# EasyEDA Pro project 焊接烟雾净化器.eprj

# Schematic 焊接烟雾净化器V1.2
Create Date: 2023-09-26; Page Name: P1; Project Name: 焊接烟雾净化器; Schematic Name: 焊接烟雾净化器V1.2; Update Date: 2023-09-26; Company: 嘉立创EDA; Page Size: A3; Version: V1.0
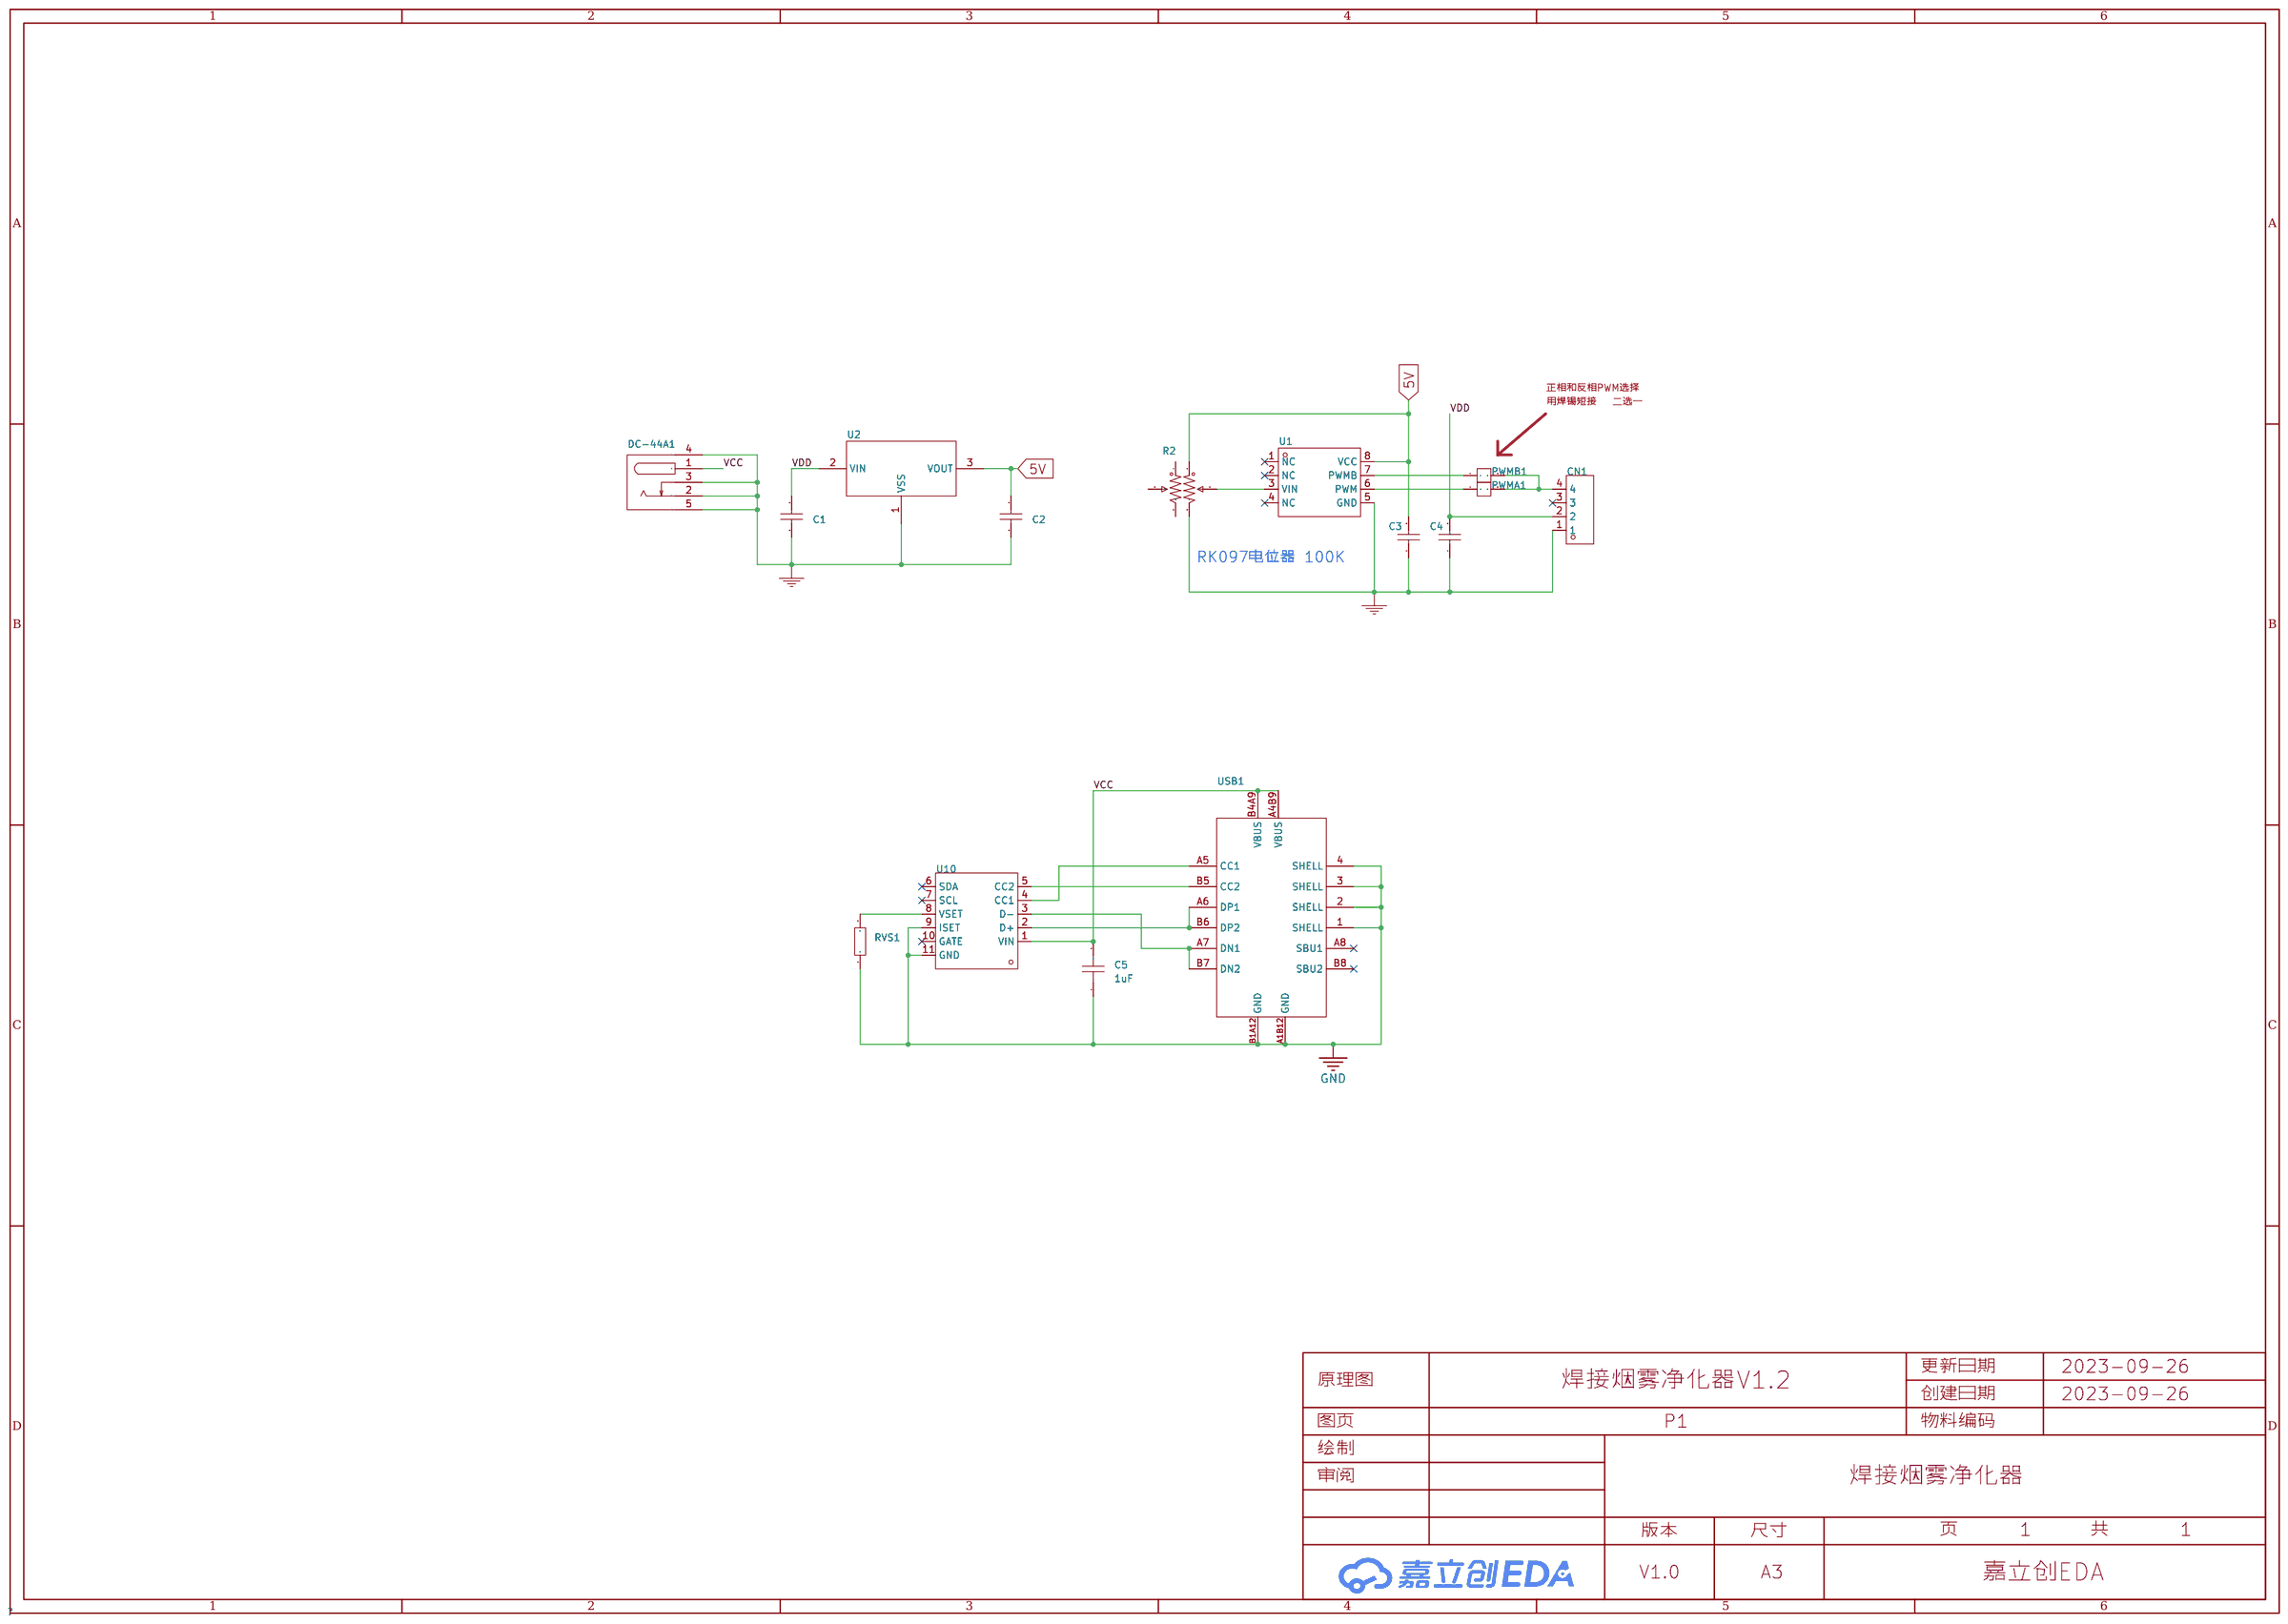
[diagram p0: schematic sheet]

## Parts
C1  10uF  [C0603]
C2  10uF  [C0603]
C3  10uF  [C0603]
C4  10uF  [C0603]
C5  1uF  [C0603]
CN1  KF2510-4AGW-GW  [CONN-TH_4P-P2.54_CAX_KF2510-4AGW-GW]
DC-44A1  DC-044A-20A  [DC-IN-TH_DC-044A-20A]
PWMA1  -  [cs]
PWMB1  -  [cs]
R2  100kΩ  [RES-ADJ-TH_RK09712200MY]
RVS1  10kΩ  [R0603]
U1  GP9101-F20K-L2H1-SW  [SOP-8_L5.0-W3.9-P1.27-LS6.0-BL]
U2  ME6203A50PG  [SOT-89_L4.5-W2.5-P1.50-LS4.2-BR]
U10  HUSB238-002D  [TDFN-10_L3.0-W3.0-P0.50-BL-EP]
USB1  -  [USB_C-SMD_TYPE_C16PIN]

## Library data of the parts
C1-C4 = GRM188R6YA106MA73D: 容值:10uF;精度:±20%;额定电压:35V;材质(温度系数):-;; LCSC Part Name: 10uF ±20% 35V; Supplier Part: C194427; Manufacturer: muRata(村田); Supplier Footprint: 0603; JLCPCB Part Class: Extended Part; Datasheet: https://atta.szlcsc.com/upload/public/pdf/source/20210128/C194427_FCA3640823207DDB58700A82F1A19B5F.pdf; Supplier: LCSC; Tolerance: ±20%; Voltage Rated: 35V
C5 = CL10A105KL8NNNC: 容值:1uF;精度:±10%;额定电压:35V;材质(温度系数):-;; LCSC Part Name: 1uF ±10% 35V; Supplier Part: C478859; Manufacturer: SAMSUNG(三星); Supplier Footprint: 0603; JLCPCB Part Class: 扩展库; Datasheet: https://atta.szlcsc.com/upload/public/pdf/source/20200102/C478859_0EBF0387113597ECF4C91C52A34CAFD4.pdf; Supplier: LCSC; Tolerance: ±10%; Voltage Rated: 35V
CN1 = KF2510-4AGW-GW: 参考系列:-;间距:2.54mm;插针结构:1x4P;排数:1;每排PIN数:4;行距:-;公母:公型插针;安装方式:弯插;额定电流:3A;工作温度范围:-25℃~+85℃;; LCSC Part Name: 2.54mm 1x4P 弯插; Supplier Part: C722747; Manufacturer: CAX(创都); Supplier Footprint: 弯插,P=2.54mm; JLCPCB Part Class: 扩展库; Datasheet: https://atta.szlcsc.com/upload/public/pdf/source/20200903/C722719_349FB032BA69A16250788D6DAC1BEE3A.pdf; Supplier: LCSC; Pitch: 2.54mm; Pins Structure: 1x4P; Number of Rows: 1; Number of PINs Per Row: 4; Gender: 公型插针; Mounting Style: 弯插; Current Rating (Max): 3A; Operating Temperature Range: -25℃~+85℃
DC-44A1 = DC-044A-20A: 触点内径:2mm;触点外径:0.9mm;; LCSC Part Name: DC座 内铁芯2.0 11.6mm*10.1mm; Supplier Part: C129006; Manufacturer: 韩国韩荣; Supplier Footprint: Through Hole; JLCPCB Part Class: 扩展库; Datasheet: https://atta.szlcsc.com/upload/public/pdf/source/20210810/C8974B0AB7FDF70EB0A74D74746E6460.pdf; Supplier: LCSC; Inside Contact Diameter: 2mm; Outside Contact Diameter: 0.9mm
PWMA1 PWMB1 = cs
R2 = RK09712200MY: 阻值:10kΩ;精度:±20%;; LCSC Part Name: 10kΩ ±20% 三件套; Supplier Part: C231763; Manufacturer: ALPSALPINE(阿尔卑斯阿尔派); Supplier Footprint: 插件; JLCPCB Part Class: 扩展库; Datasheet: https://atta.szlcsc.com/upload/public/pdf/source/20180613/C231763_9E66DA42F71BD8737D63C600D8EF512E.pdf; Supplier: LCSC; Tolerance: ±20%
RVS1 = 0603WAF1002T5E: 电阻类型:厚膜电阻;阻值:10kΩ;精度:±1%;功率:100mW;; LCSC Part Name: 厚膜电阻 10kΩ ±1% 100mW; Supplier Part: C25804; Manufacturer: UNI-ROYAL(厚声); Supplier Footprint: 0603; JLCPCB Part Class: 基础库; Datasheet: https://atta.szlcsc.com/upload/public/pdf/source/20200306/C422600_1E6D84923E4A46A82E41ADD87F860B5C.pdf; Supplier: LCSC; Type: 厚膜电阻; Tolerance: ±1%; Power(Watts): 100mW; Temperature Coefficient: ±100ppm/℃; Overload Voltage (Max): 75V; Operating Temperature Range: -55℃~+155℃
U1 = GP9101-F20K-L2H1-SW: GP9101 0-VCC转PWM 20KHz L2H1; LCSC Part Name: 模拟信号转PWM信号; Supplier Part: C2837710; Manufacturer: Guestgood(客益); Supplier Footprint: SOP8; JLCPCB Part Class: 扩展库; Datasheet: https://atta.szlcsc.com/upload/public/pdf/source/20210611/C2837710_B55E2012AD9BA99B0BFF632E52DE3359.pdf; Supplier: LCSC
U2 = ME6203A50PG: 输出类型:固定;输出极性:正;输出通道数:1;最大输入电压:30V;输出电压:5V;压差:-;输出电流:100mA;电源纹波抑制比(PSRR):40dB@(1kHz);; LCSC Part Name: 正 Vin=30V Vout=5V 100mA 40dB@(1kHz); Supplier Part: C94056; Manufacturer: MICRONE(南京微盟); Supplier Footprint: SOT-89; JLCPCB Part Class: 扩展库; Datasheet: https://atta.szlcsc.com/upload/public/pdf/source/20170116/1484561288466.pdf; Supplier: LCSC; Output Type: 固定; Output Polarity: 正; Number of Outputs: 1; Maximum Input Voltage: 30V; Output Voltage: 5V; Output Current: 100mA; Power Supply Rejection Ratio (PSRR): 40dB@(1kHz)
U10 = HUSB238-002D: Supplier Part: C2765038; JLCPCB Part Class: 扩展库; Supplier: LCSC
USB1 = TYPE-C16P: Supplier: LCSC; Supplier Part: C393939; Manufacturer: SHOU HAN; Manufacturer Part: TYPE-C16PIN; JLCPCB Part Class: 扩展库

## Nets
5V: C2.2 C3.2 R2.1 U1.8(VCC) U2.3(VOUT)
GND: C1.1 C2.1 C3.1 C4.1 C5.1 CN1.1 DC-44A1.2 DC-44A1.3 DC-44A1.4 DC-44A1.5 R2.3 RVS1.1 U1.5(GND) U2.1(VSS) U10.9(ISET) U10.11(GND) USB1.1(SHELL) USB1.2(SHELL) USB1.3(SHELL) USB1.4(SHELL) USB1.A1B12(GND) USB1.B1A12(GND)
VCC: C5.2 DC-44A1.1 U10.1(VIN) USB1.A4B9(VBUS) USB1.B4A9(VBUS)
VDD: C1.2 C4.2 CN1.2 U2.2(VIN)
$1N762: R2.2 U1.3(VIN)
$1N878: U10.5(CC2) USB1.B5(CC2)
$1N881: U10.4(CC1) USB1.A5(CC1)
$1N891: RVS1.2 U10.8(VSET)
$1N943: U10.2(D+) USB1.A6(DP1) USB1.B6(DP2)
$1N946: U10.3(D-) USB1.A7(DN1) USB1.B7(DN2)
$1N1655: PWMA1.1 U1.6(PWM)
$1N1658: PWMB1.1 U1.7(PWMB)
$1N1664: CN1.4 PWMA1.2 PWMB1.2

Not connected (* = marked no-connect by the designer): CN1 3*; R2 4 5 6; U1 1(NC)* 2(NC)* 4(NC)*; U10 6(SDA)* 7(SCL)* 10(GATE)*; USB1 A8(SBU1)* B8(SBU2)*

## Notes on the sheet
- 正相和反相PWM选择
- 用焊锡短接   二选一
- RK097电位器 100K

# Schematic Schematic1
Create Date: 2023-09-26; Page Name: P1; Project Name: 焊接烟雾净化器; Schematic Name: Schematic1; Update Date: 2023-09-26; Company: 嘉立创EDA; Page Size: A4; Version: V1.0
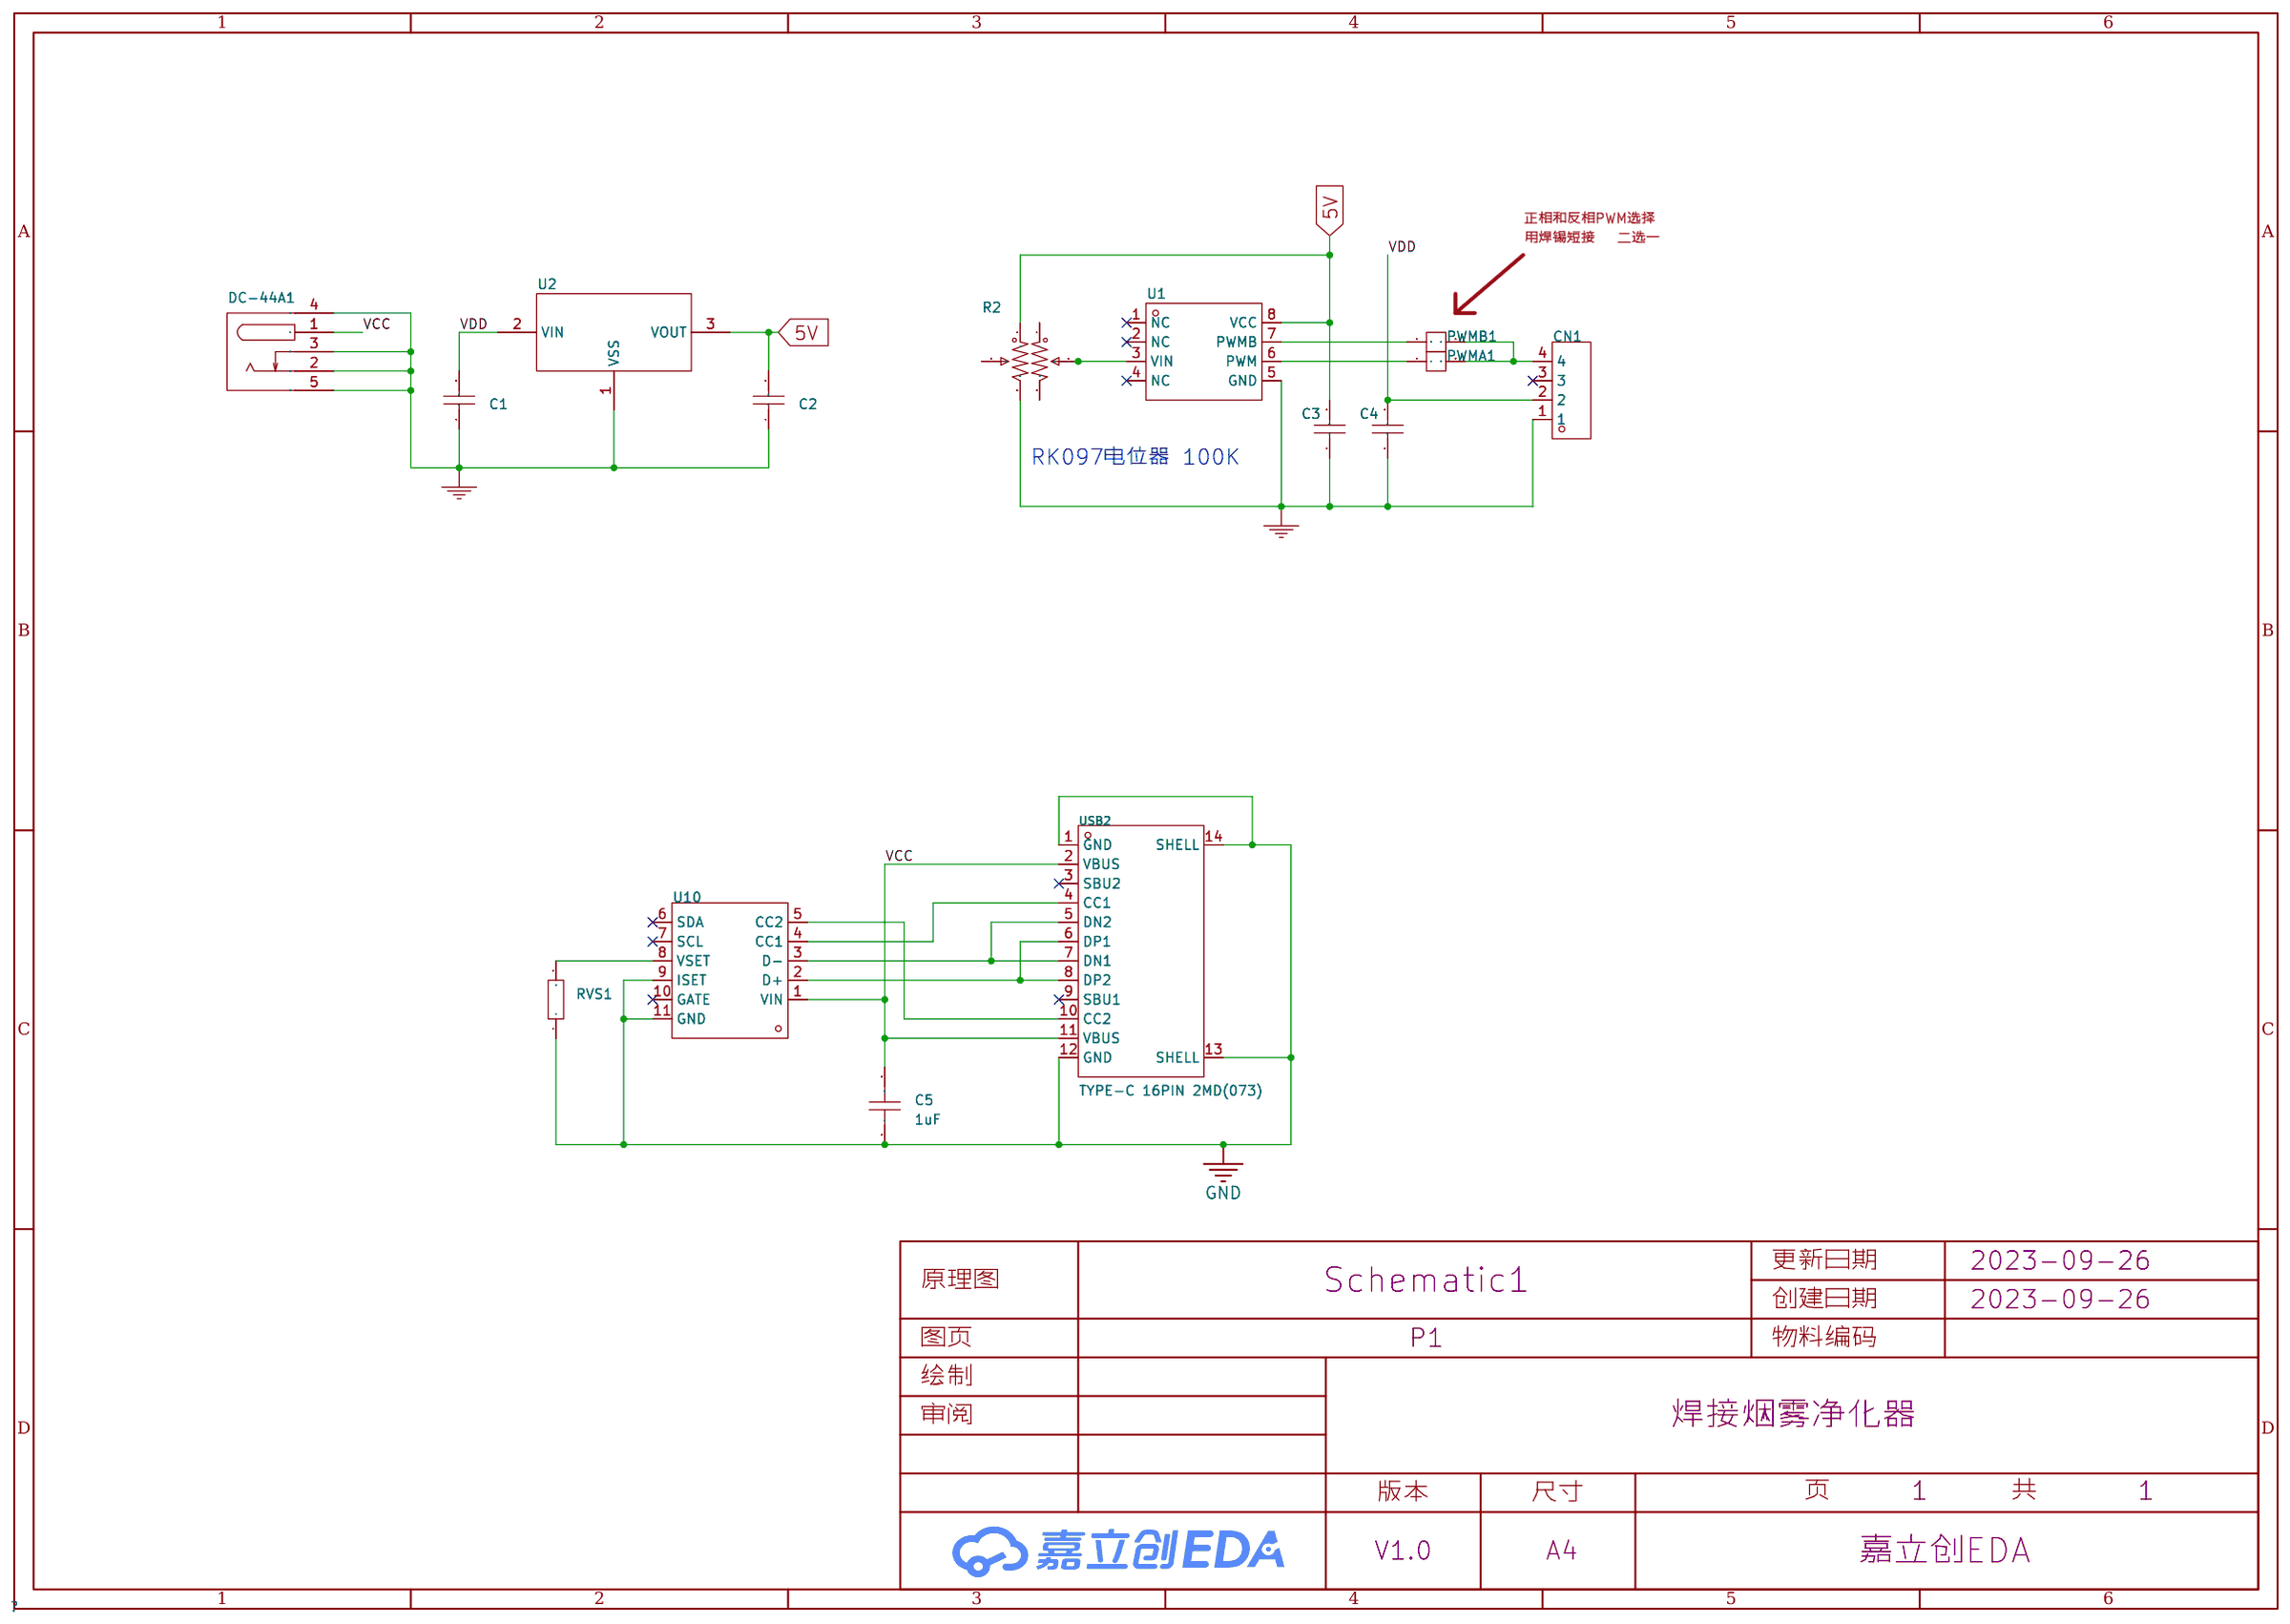
[diagram p1: schematic sheet]

## Parts
C1  10uF  [C0603]
C2  10uF  [C0603]
C3  10uF  [C0603]
C4  10uF  [C0603]
C5  1uF  [C0603]
CN1  KF2510-4AGW-GW  [CONN-TH_4P-P2.54_CAX_KF2510-4AGW-GW]
DC-44A1  DC-044A-20A  [DC-IN-TH_DC-044A-20A]
PWMA1  -  [cs]
PWMB1  -  [cs]
R2  10kΩ  [RES-ADJ-TH_RK09712200MY]
RVS1  10kΩ  [R0603]
U1  GP9101-F20K-L2H1-SW  [SOP-8_L5.0-W3.9-P1.27-LS6.0-BL]
U2  AMS1117-5.0  [SOT-89-3_L4.5-W2.5-P1.50-LS4.2-BR]
U10  HUSB238-002D  [TDFN-10_L3.0-W3.0-P0.50-BL-EP]
USB2  TYPE-C 16PIN 2MD(073)  [USB-C-SMD_TYPE-C-6PIN-2MD-073]

## Library data of the parts
C1-C4 = GRM188R6YA106MA73D: 容值:10uF;精度:±20%;额定电压:35V;材质(温度系数):-;; LCSC Part Name: 10uF ±20% 35V; Supplier Part: C194427; Manufacturer: muRata(村田); Supplier Footprint: 0603; JLCPCB Part Class: Extended Part; Datasheet: https://atta.szlcsc.com/upload/public/pdf/source/20210128/C194427_FCA3640823207DDB58700A82F1A19B5F.pdf; Supplier: LCSC; Tolerance: ±20%; Voltage Rated: 35V
C5 = CL10A105KL8NNNC: 容值:1uF;精度:±10%;额定电压:35V;材质(温度系数):-;; LCSC Part Name: 1uF ±10% 35V; Supplier Part: C478859; Manufacturer: SAMSUNG(三星); Supplier Footprint: 0603; JLCPCB Part Class: 扩展库; Datasheet: https://atta.szlcsc.com/upload/public/pdf/source/20200102/C478859_0EBF0387113597ECF4C91C52A34CAFD4.pdf; Supplier: LCSC; Tolerance: ±10%; Voltage Rated: 35V
CN1 = KF2510-4AGW-GW: 参考系列:-;间距:2.54mm;插针结构:1x4P;排数:1;每排PIN数:4;行距:-;公母:公型插针;安装方式:弯插;额定电流:3A;工作温度范围:-25℃~+85℃;; LCSC Part Name: 2.54mm 1x4P 弯插; Supplier Part: C722747; Manufacturer: CAX(创都); Supplier Footprint: 弯插,P=2.54mm; JLCPCB Part Class: 扩展库; Datasheet: https://atta.szlcsc.com/upload/public/pdf/source/20200903/C722719_349FB032BA69A16250788D6DAC1BEE3A.pdf; Supplier: LCSC; Pitch: 2.54mm; Pins Structure: 1x4P; Number of Rows: 1; Number of PINs Per Row: 4; Gender: 公型插针; Mounting Style: 弯插; Current Rating (Max): 3A; Operating Temperature Range: -25℃~+85℃
DC-44A1 = DC-044A-20A: 触点内径:2mm;触点外径:0.9mm;; LCSC Part Name: DC座 内铁芯2.0 11.6mm*10.1mm; Supplier Part: C129006; Manufacturer: 韩国韩荣; Supplier Footprint: Through Hole; JLCPCB Part Class: 扩展库; Datasheet: https://atta.szlcsc.com/upload/public/pdf/source/20210810/C8974B0AB7FDF70EB0A74D74746E6460.pdf; Supplier: LCSC; Inside Contact Diameter: 2mm; Outside Contact Diameter: 0.9mm
PWMA1 PWMB1 = cs
R2 = RK09712200MY: 阻值:10kΩ;精度:±20%;; LCSC Part Name: 10kΩ ±20% 三件套; Supplier Part: C231763; Manufacturer: ALPSALPINE(阿尔卑斯阿尔派); Supplier Footprint: 插件; JLCPCB Part Class: Extended Part; Datasheet: https://atta.szlcsc.com/upload/public/pdf/source/20191107/C444934_DB02548289CDA4D147B389ED0787F1D2.pdf; Supplier: LCSC; Tolerance: ±20%; NO_CONNECT: yes
RVS1 = 0603WAF1002T5E: 电阻类型:厚膜电阻;阻值:10kΩ;精度:±1%;功率:100mW;; LCSC Part Name: 厚膜电阻 10kΩ ±1% 100mW; Supplier Part: C25804; Manufacturer: UNI-ROYAL(厚声); Supplier Footprint: 0603; JLCPCB Part Class: 基础库; Datasheet: https://atta.szlcsc.com/upload/public/pdf/source/20200306/C422600_1E6D84923E4A46A82E41ADD87F860B5C.pdf; Supplier: LCSC; Type: 厚膜电阻; Tolerance: ±1%; Power(Watts): 100mW; Temperature Coefficient: ±100ppm/℃; Overload Voltage (Max): 75V; Operating Temperature Range: -55℃~+155℃
U1 = GP9101-F20K-L2H1-SW: GP9101 0-VCC转PWM 20KHz L2H1; LCSC Part Name: 模拟信号转PWM信号; Supplier Part: C2837710; Manufacturer: Guestgood(客益); Supplier Footprint: SOP8; JLCPCB Part Class: 扩展库; Datasheet: https://atta.szlcsc.com/upload/public/pdf/source/20210611/C2837710_B55E2012AD9BA99B0BFF632E52DE3359.pdf; Supplier: LCSC
U2 = AMS1117-5.0: 输出类型:-;; Supplier Part: C880753; Manufacturer: Slkor(萨科微); Supplier Footprint: SOT-89-3; JLCPCB Part Class: Extended Part; Datasheet: https://atta.szlcsc.com/upload/public/pdf/source/20190906/C426566_95BE246DE70C248781207323626ADB09.pdf; Supplier: LCSC; Output Polarity: 正; Number of Outputs: 1; Maximum Input Voltage: 30V; Output Voltage: 5V; Output Current: 100mA; Power Supply Rejection Ratio (PSRR): 40dB@(1kHz)
U10 = HUSB238-002D: Supplier Part: C2765038; JLCPCB Part Class: 扩展库; Supplier: LCSC
USB2 = TYPE-C 16PIN 2MD(073): 连接器类型:Type-C;标准:-;公母:母座;触点数量:16;端口数量:1;安装方式:卧贴;额定电流 - 电源:5A;工作温度范围:-25℃~+85℃;; LCSC Part Name: TYPE-C母座 16P 4脚插件带定位柱 不锈钢外壳 2次模顶; Supplier Part: C2765186; Manufacturer: SHOU HAN(首韩); Supplier Footprint: SMD; JLCPCB Part Class: Extended Part; Supplier: LCSC; Connector Type: Type-C; Gender: 母座; Number of Contacts: 16; Number of Ports: 1; Mounting Style: 卧贴; Current Rating - Power (Max): 5A; Operating Temperature Range: -25℃~+85℃

## Nets
5V: C2.2 C3.2 R2.1 U1.8(VCC) U2.3(VOUT)
GND: C1.1 C2.1 C3.1 C4.1 C5.1 CN1.1 DC-44A1.2 DC-44A1.3 DC-44A1.4 DC-44A1.5 R2.3 RVS1.1 U1.5(GND) U2.1(VSS) U10.9(ISET) U10.11(GND) USB2.1(GND) USB2.12(GND) USB2.13(SHELL) USB2.14(SHELL)
VCC: C5.2 DC-44A1.1 U10.1(VIN) USB2.2(VBUS) USB2.11(VBUS)
VDD: C1.2 C4.2 CN1.2 U2.2(VIN)
$1N711: RVS1.2 U10.8(VSET)
$1N714: PWMA1.1 U1.6(PWM)
$1N715: PWMB1.1 U1.7(PWMB)
$1N716: CN1.4 PWMA1.2 PWMB1.2
$1N2394: U10.4(CC1) USB2.4(CC1)
$1N2483: U10.3(D-) USB2.5(DN2) USB2.7(DN1)
$1N2497: U10.2(D+) USB2.6(DP1) USB2.8(DP2)
$1N2626: U10.5(CC2) USB2.10(CC2)
Net-(R2-5): R2.5 U1.3(VIN)

Not connected (* = marked no-connect by the designer): CN1 3*; R2 2 4 6; U1 1(NC)* 2(NC)* 4(NC)*; U10 6(SDA)* 7(SCL)* 10(GATE)*; USB2 3(SBU2)* 9(SBU1)*

## Notes on the sheet
- 正相和反相PWM选择
- 用焊锡短接   二选一
- RK097电位器 100K

# Schematic 焊接烟雾净化器v1.3
Create Date: 2023-10-03; Page Name: P1; Project Name: 焊接烟雾净化器; Schematic Name: 焊接烟雾净化器v1.3; Update Date: 2023-10-03; Company: 嘉立创EDA; Page Size: A3; Version: V1.0
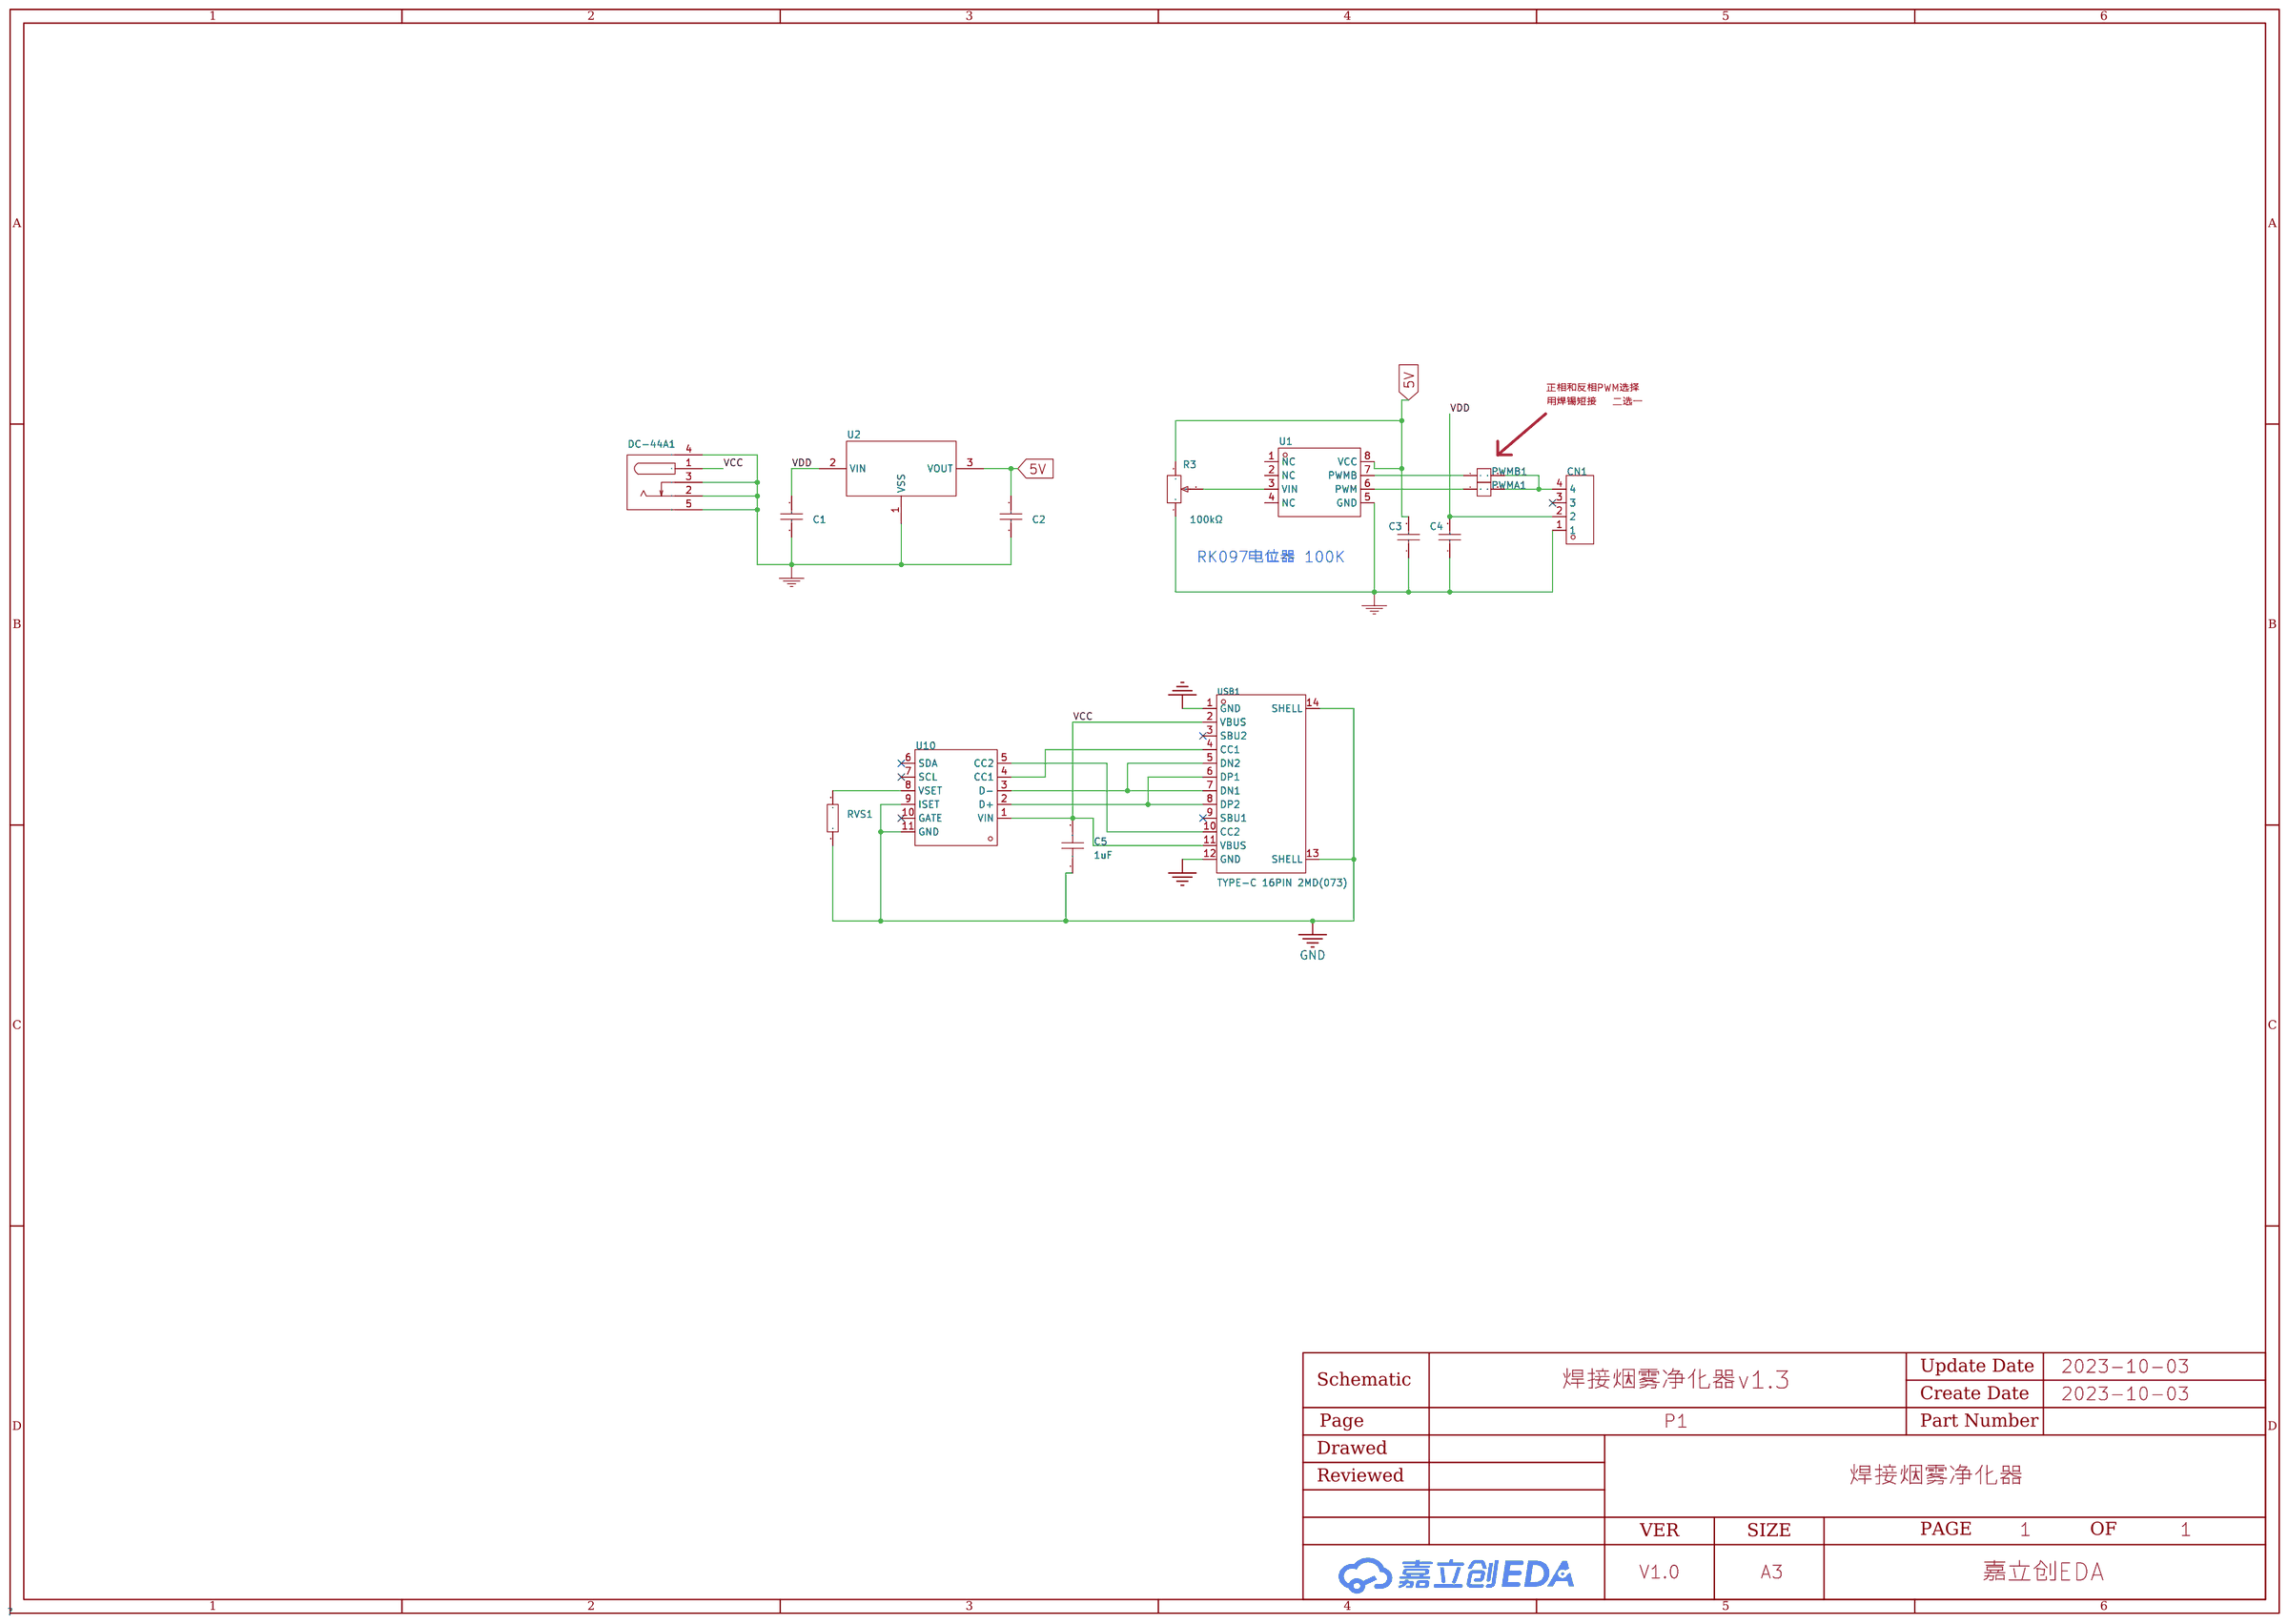
[diagram p2: schematic sheet]

## Parts
C1  10uF  [C0603]
C2  10uF  [C0603]
C3  10uF  [C0603]
C4  10uF  [C0603]
C5  1uF  [C0603]
CN1  KF2510-4AGW-GW  [CONN-TH_4P-P2.54_CAX_KF2510-4AGW-GW]
DC-44A1  DC-044A-20A  [DC-IN-TH_DC-044A-20A]
PWMA1  -  [cs]
PWMB1  -  [cs]
R3  100kΩ  [RES-ADJ-TH_3296X-8MM]
RVS1  10kΩ  [R0603]
U1  GP9101-F1K-L2H1-SW  [SOP-8_L5.0-W3.9-P1.27-LS6.0-BL]
U2  ME6203A50PG  [SOT-89_L4.5-W2.5-P1.50-LS4.2-BR]
U10  HUSB238_002DD  [DFN-10_L3.0-W3.0-P0.50-BL-EP2.5]
USB1  TYPE-C 16PIN 2MD(073)  [USB-C-SMD_TYPE-C-6PIN-2MD-073]

## Library data of the parts
C1-C4 = GRM188R6YA106MA73D: 容值:10uF;精度:±20%;额定电压:35V;材质(温度系数):-;; LCSC Part Name: 10uF ±20% 35V; Supplier Part: C194427; Manufacturer: muRata(村田); Supplier Footprint: 0603; JLCPCB Part Class: Extended Part; Datasheet: https://atta.szlcsc.com/upload/public/pdf/source/20210128/C194427_FCA3640823207DDB58700A82F1A19B5F.pdf; Supplier: LCSC; Tolerance: ±20%; Voltage Rated: 35V
C5 = CL10A105KL8NNNC: 容值:1uF;精度:±10%;额定电压:35V;材质(温度系数):-;; LCSC Part Name: 1uF ±10% 35V; Supplier Part: C478859; Manufacturer: SAMSUNG(三星); Supplier Footprint: 0603; JLCPCB Part Class: 扩展库; Datasheet: https://atta.szlcsc.com/upload/public/pdf/source/20200102/C478859_0EBF0387113597ECF4C91C52A34CAFD4.pdf; Supplier: LCSC; Tolerance: ±10%; Voltage Rated: 35V
CN1 = KF2510-4AGW-GW: 参考系列:-;间距:2.54mm;插针结构:1x4P;排数:1;每排PIN数:4;行距:-;公母:公型插针;安装方式:弯插;额定电流:3A;工作温度范围:-25℃~+85℃;; LCSC Part Name: 2.54mm 1x4P 弯插; Supplier Part: C722747; Manufacturer: CAX(创都); Supplier Footprint: 弯插,P=2.54mm; JLCPCB Part Class: 扩展库; Datasheet: https://atta.szlcsc.com/upload/public/pdf/source/20200903/C722719_349FB032BA69A16250788D6DAC1BEE3A.pdf; Supplier: LCSC; Pitch: 2.54mm; Pins Structure: 1x4P; Number of Rows: 1; Number of PINs Per Row: 4; Gender: 公型插针; Mounting Style: 弯插; Current Rating (Max): 3A; Operating Temperature Range: -25℃~+85℃
DC-44A1 = DC-044A-20A: 触点内径:2mm;触点外径:0.9mm;; LCSC Part Name: DC座 内铁芯2.0 11.6mm*10.1mm; Supplier Part: C129006; Manufacturer: 韩国韩荣; Supplier Footprint: Through Hole; JLCPCB Part Class: 扩展库; Datasheet: https://atta.szlcsc.com/upload/public/pdf/source/20210810/C8974B0AB7FDF70EB0A74D74746E6460.pdf; Supplier: LCSC; Inside Contact Diameter: 2mm; Outside Contact Diameter: 0.9mm
PWMA1 PWMB1 = cs
R3 = 3296X-1-104-8mm: 阻值:100kΩ;精度:±10%;; LCSC Part Name: 100kΩ ±10% 长柄8mm; Supplier Part: C330448; Manufacturer: BOCHEN(博晨); Supplier Footprint: 插件; JLCPCB Part Class: Extended Part; Datasheet: https://atta.szlcsc.com/upload/public/pdf/source/20181127/C330448_9E17BB69C73330C275A71CD6ED25E106.pdf; Supplier: LCSC; Tolerance: ±10%
RVS1 = 0603WAF1002T5E: 电阻类型:厚膜电阻;阻值:10kΩ;精度:±1%;功率:100mW;; LCSC Part Name: 厚膜电阻 10kΩ ±1% 100mW; Supplier Part: C25804; Manufacturer: UNI-ROYAL(厚声); Supplier Footprint: 0603; JLCPCB Part Class: 基础库; Datasheet: https://atta.szlcsc.com/upload/public/pdf/source/20200306/C422600_1E6D84923E4A46A82E41ADD87F860B5C.pdf; Supplier: LCSC; Type: 厚膜电阻; Tolerance: ±1%; Power(Watts): 100mW; Temperature Coefficient: ±100ppm/℃; Overload Voltage (Max): 75V; Operating Temperature Range: -55℃~+155℃
U1 = GP9101-F1K-L2H1-SW: GP9101 0-VCC转PWM 1KHz L2H1; LCSC Part Name: 模拟信号转PWM信号; Supplier Part: C2837704; Manufacturer: Guestgood(客益); Supplier Footprint: SOP-8; JLCPCB Part Class: Extended Part; Datasheet: https://atta.szlcsc.com/upload/public/pdf/source/20230324/347DFD6DABD5C2E507926BD64C336E27.pdf; Supplier: LCSC
U2 = ME6203A50PG: 输出类型:固定;输出极性:正;输出通道数:1;最大输入电压:30V;输出电压:5V;压差:-;输出电流:100mA;电源纹波抑制比(PSRR):40dB@(1kHz);; LCSC Part Name: 正 Vin=30V Vout=5V 100mA 40dB@(1kHz); Supplier Part: C94056; Manufacturer: MICRONE(南京微盟); Supplier Footprint: SOT-89; JLCPCB Part Class: 扩展库; Datasheet: https://atta.szlcsc.com/upload/public/pdf/source/20170116/1484561288466.pdf; Supplier: LCSC; Output Type: 固定; Output Polarity: 正; Number of Outputs: 1; Maximum Input Voltage: 30V; Output Voltage: 5V; Output Current: 100mA; Power Supply Rejection Ratio (PSRR): 40dB@(1kHz)
U10 = HUSB238_002DD: HUSB238是一款高度集成的USB PD受电端芯片（PD Sink，也叫PD诱骗芯片）。传输的额定功率可达100W。它兼容PD3.0 V1.3和Type-C V1.4。它还可以支持BC1.2 DCP、CDP和SDP和Apple 5V2.4A充电协议。这种方案也被称为桶形连接器替换(Barrel Connector Replacement)，旨在替代传统的桶形连接器和DC插座(DC JACK)。HUSB238已经获得USB-IF认证，TID3666。它可以用于具有传统桶形连接器或USB micro-B电源; Supplier Part: C7471904; Manufacturer: Hynetek(慧能泰); Supplier Footprint: DFN-10L; JLCPCB Part Class: 扩展库; Supplier: LCSC
USB1 = TYPE-C 16PIN 2MD(073): 连接器类型:Type-C;标准:-;公母:母座;触点数量:16;端口数量:1;安装方式:卧贴;额定电流 - 电源:5A;工作温度范围:-25℃~+85℃;; LCSC Part Name: TYPE-C母座 16P 4脚插件带定位柱 不锈钢外壳 2次模顶; Supplier Part: C2765186; Manufacturer: SHOU HAN(首韩); Supplier Footprint: SMD; JLCPCB Part Class: Extended Part; Supplier: LCSC; Connector Type: Type-C; Gender: 母座; Number of Contacts: 16; Number of Ports: 1; Mounting Style: 卧贴; Current Rating - Power (Max): 5A; Operating Temperature Range: -25℃~+85℃

## Nets
5V: C2.2 C3.2 R3.3 U1.8(VCC) U2.3(VOUT)
GND: C1.1 C2.1 C3.1 C4.1 C5.1 CN1.1 DC-44A1.2 DC-44A1.3 DC-44A1.4 DC-44A1.5 R3.1 RVS1.1 U1.5(GND) U2.1(VSS) U10.9(ISET) U10.11(GND) USB1.1(GND) USB1.12(GND) USB1.13(SHELL) USB1.14(SHELL)
VCC: C5.2 DC-44A1.1 U10.1(VIN) USB1.2(VBUS) USB1.11(VBUS)
VDD: C1.2 C4.2 CN1.2 U2.2(VIN)
$1N762: R3.2 U1.3(VIN)
$1N881: U10.4(CC1) USB1.4(CC1)
$1N891: RVS1.2 U10.8(VSET)
$1N1655: PWMA1.1 U1.6(PWM)
$1N1658: PWMB1.1 U1.7(PWMB)
$1N1664: CN1.4 PWMA1.2 PWMB1.2
$1N2783: U10.5(CC2) USB1.10(CC2)
$1N2796: U10.2(D+) USB1.6(DP1) USB1.8(DP2)
$1N2819: U10.3(D-) USB1.5(DN2) USB1.7(DN1)

Not connected (* = marked no-connect by the designer): CN1 3*; U1 1(NC) 2(NC) 4(NC); U10 6(SDA)* 7(SCL)* 10(GATE)*; USB1 3(SBU2)* 9(SBU1)*

## Notes on the sheet
- 正相和反相PWM选择
- 用焊锡短接   二选一
- RK097电位器 100K

# Board 焊接烟雾净化器V1.2
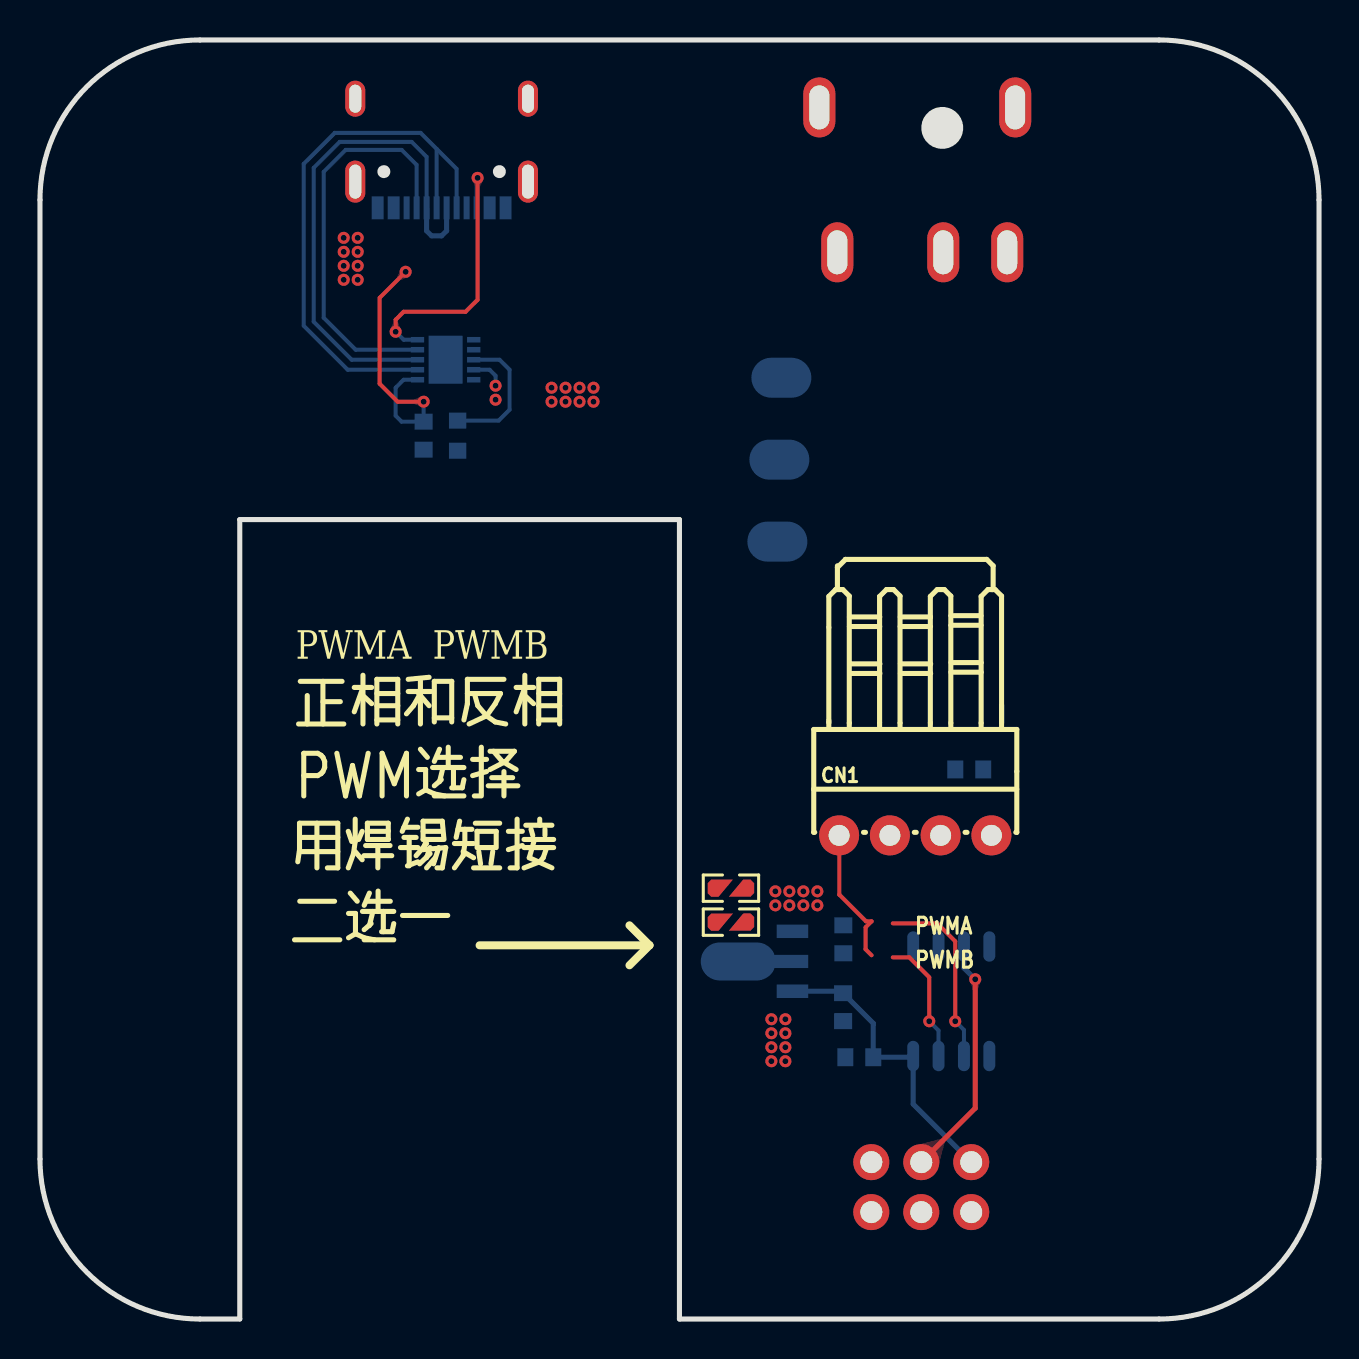
[diagram p3: board, top side]
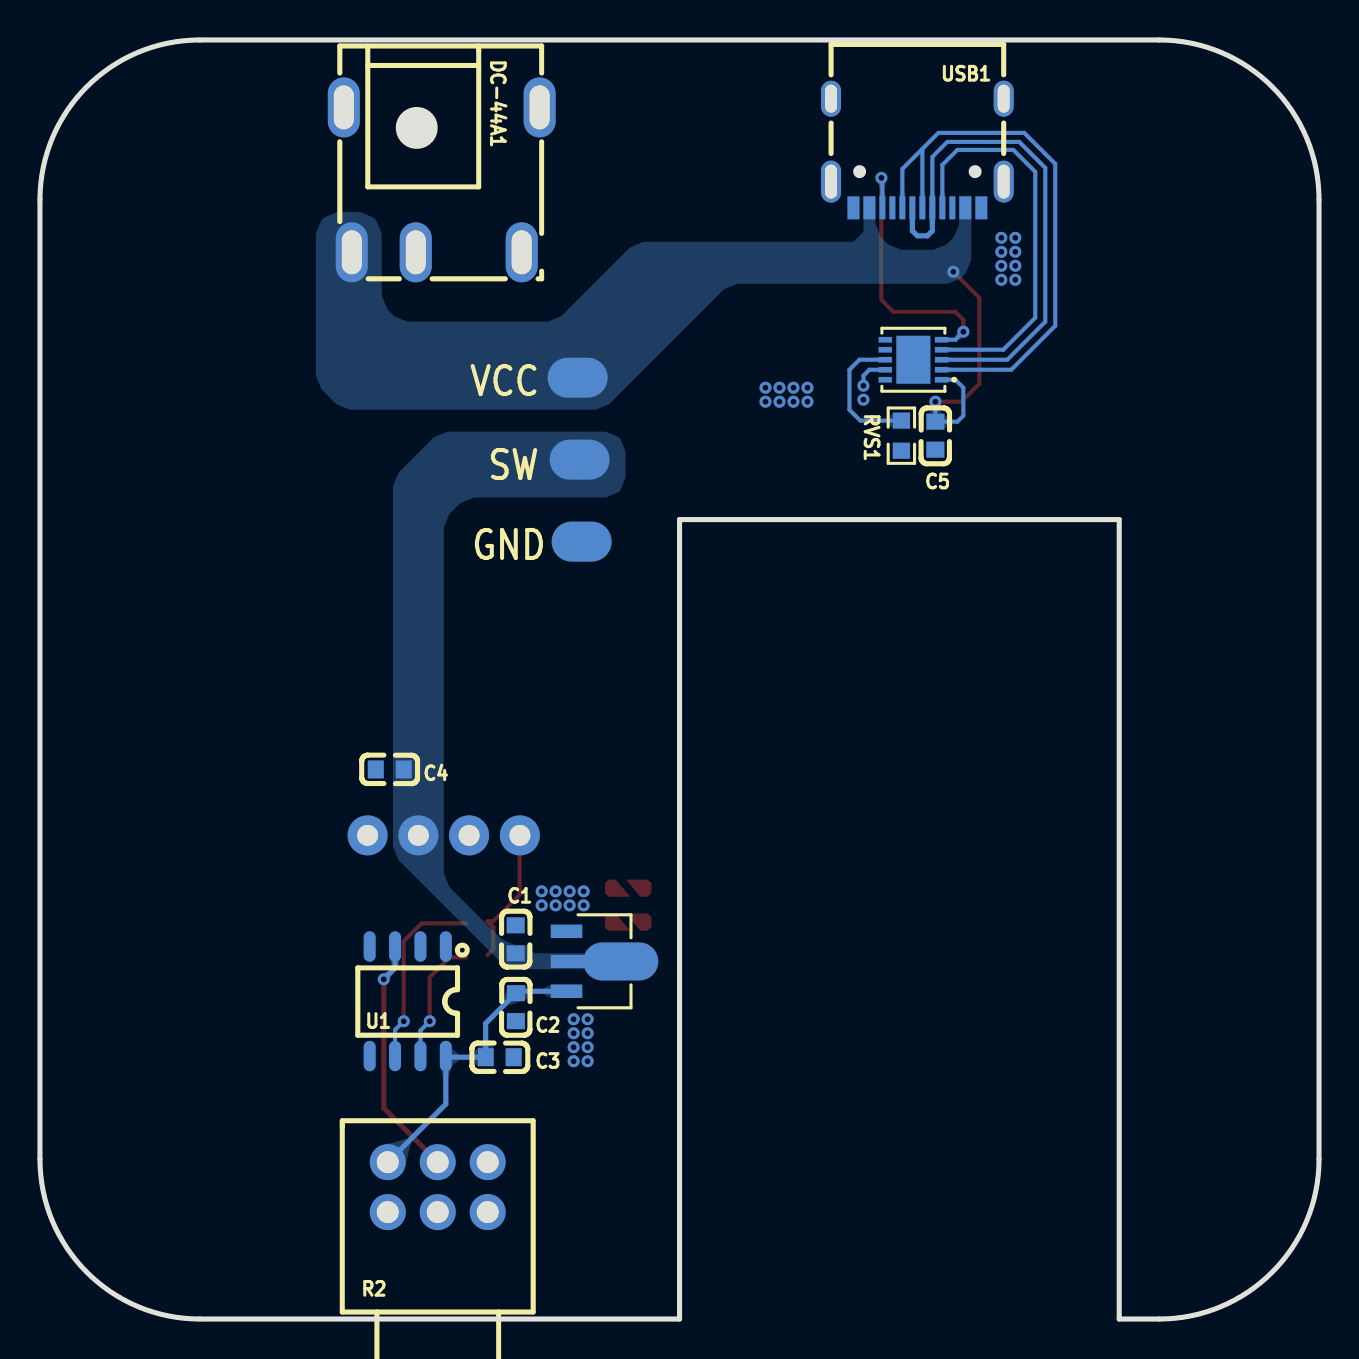
[diagram p4: board, bottom side, seen from below]

Outline 64 x 64 mm; copper layers: Top Layer, Bottom Layer. Coordinates in mm from the lower left corner of the outline.
Outline path: 0,56 arc(2.34,61.66) 8,64 56,64 arc(61.66,61.66) 64,56 64,8 arc(61.66,2.34) 56,0 32,0 32,40 10,40 10,0 8,0 arc(2.34,2.34) 0,8 0,56
Stack: Top Layer 0.035mm / Dielectric1 1.51mm FR4 er 4.5 / Bottom Layer 0.035mm

## Design rules (mm)
spacing safeClearance (default): track to track 0.152, other pairs 0.152 to 0.3
track width trackWidth (default): min 0.127, default 0.254, max 2.54
differential pair differentialPair (default): width min 0.127, default 0.254, max 2.54; gap min 0.152, default 0.152
via viaSize (default): diameter min 0.5, default 0.61, max 10; hole min 0.3, default 0.305, max 6

## Placement (name value [footprint] x y rotation side)
C1  10uF  [C0603]  40.2 19 270 bottom
C2  10uF  [C0603]  40.19 15.6 90 bottom
C3  10uF  [C0603]  41 13.1 0 bottom
C4  10uF  [C0603]  46.5 27.5 180 bottom
C5  1uF  [C0603]  19.2 44.2 90 bottom
CN1  KF2510-4AGW-GW  [CONN-TH_4P-P2.54_CAX_KF2510-4AGW-GW]  43.8 24.2 180 top
DC-44A1  DC-044A-20A  [DC-IN-TH_DC-044A-20A]  43.9 57 270 bottom
NOREF  -  [Pad_e146]  37 43 0 top
NOREF#2  -  [Pad_e144]  37.1 47.1 0 top
NOREF#3  -  [Pad_e150]  36.9 38.9 0 top
PWMA1  -  [cs]  42.14 19.85 180 top
PWMB1  -  [cs]  42.14 18.15 180 top
R2  100kΩ  [RES-ADJ-TH_RK09712200MY]  44.1 6.6 180 bottom
RVS1  10kΩ  [R0603]  20.9 44.2 90 bottom
U1  GP9101-F20K-L2H1-SW  [SOP-8_L5.0-W3.9-P1.27-LS6.0-BL]  45.6 15.9 0 bottom
U2  ME6203A50PG  [SOT-89_L4.5-W2.5-P1.50-LS4.2-BR]  36.3 17.9 0 bottom
U10  HUSB238-002D  [TDFN-10_L3.0-W3.0-P0.50-BL-EP]  20.3 48 90 bottom
USB1  -  [USB_C-SMD_TYPE_C16PIN]  20.1 58.7 0 bottom

## Footprints (pads in the part's own frame, mm; a bottom-side part is the same pattern mirrored in y, then rotated)
C0603
  rect 0.8x0.9 smd: 1(-0.7,0) 2(0.7,0)
CONN-TH_4P-P2.54_CAX_KF2510-4AGW-GW
  round 2 hole 1.05: 1(-3.81,0) 2(-1.27,0) 3(1.27,0) 4(3.81,0)
cs
  custom 1.26x0.86 smd: 1(7.04,-1.66) 2(8.1,-1.764)
DC-IN-TH_DC-044A-20A
  oval 3x1.6 hole 2.2x1: 1(3.625,-4.5) 2(3.625,4.001) 3(3.625,-1.3) 4(-3.625,-4.9) 5(-3.625,4.9)
Pad_e144
  oval 3x2 smd far side: 1(0,0)
Pad_e146
  oval 3x2 smd far side: 1(0,0)
Pad_e150
  oval 3x2 smd far side: 1(0,0)
R0603
  rect 0.806x0.864 smd: 1(-0.753,0) 2(0.753,0)
RES-ADJ-TH_RK09712200MY
  round 1.8 hole 1.1: 1(-2.5,1.25) 2(0,1.25) 3(2.5,1.25) 4(-2.5,-1.25) 5(0,-1.25) 6(2.5,-1.25)
SOP-8_L5.0-W3.9-P1.27-LS6.0-BL
  oval 0.6x1.52 smd: 1(-1.905,-2.74) 2(-0.635,-2.74) 3(0.635,-2.74) 4(1.905,-2.74) 5(1.905,2.74) 6(0.635,2.74) 7(-0.635,2.74) 8(-1.905,2.74)
SOT-89_L4.5-W2.5-P1.50-LS4.2-BR
  rect 1.575x0.672 smd: 1(1.356,-1.5) 3(1.356,1.5)
  custom 5.377x1.9 smd: 2(-1.356,0.009)
TDFN-10_L3.0-W3.0-P0.50-BL-EP
  rect 0.28x0.665 smd: 1(-1,-1.407) 2(-0.5,-1.407) 3(0,-1.407) 4(0.5,-1.407) 5(1,-1.407) 6(1,1.407) 7(0.5,1.407) 8(0,1.407) 9(-0.5,1.407) 10(-1,1.407)
  rect 2.4x1.7 smd: 11(0,0)
USB_C-SMD_TYPE_C16PIN
  oval 1x2.1 hole 0.6x1.7: 1(-4.32,1.788) 2(4.32,1.788)
  oval 1x1.8 hole 0.6x1.4: 3(-4.32,-2.362) 4(4.32,-2.362)
  rect 0.6x1.15 smd: A1B12(-3.2,3.1) A4B9(-2.4,3.1) B1A12(3.2,3.1) B4A9(2.4,3.1)
  rect 0.3x1.15 smd: A5(-1.25,3.1) A6(-0.25,3.1) A7(0.25,3.1) A8(-1.75,3.1) B5(1.75,3.1) B6(0.75,3.1) B7(-0.75,3.1) B8(1.25,3.1)

## Nets
5V: C2.2 C3.2 R2.1 U1.8 U2.3
GND: C1.1 C2.1 C3.1 C4.1 C5.1 CN1.1 DC-44A1.2 DC-44A1.3 DC-44A1.4 DC-44A1.5 NOREF#3.1 R2.3 RVS1.1 U1.5 U2.1 U10.9 U10.11 USB1.1 USB1.2 USB1.3 USB1.4 USB1.A1B12 USB1.B1A12
VCC: C5.2 DC-44A1.1 NOREF#2.1 U10.1 USB1.A4B9 USB1.B4A9
VDD: C1.2 C4.2 CN1.2 NOREF.1 U2.2
$1N762: R2.2 U1.3
$1N878: U10.5 USB1.B5
$1N881: U10.4 USB1.A5
$1N891: RVS1.2 U10.8
$1N943: U10.2 USB1.A6 USB1.B6
$1N946: U10.3 USB1.A7 USB1.B7
$1N1655: PWMA1.1 U1.6
$1N1658: PWMB1.1 U1.7
$1N1664: CN1.4 PWMA1.2 PWMB1.2

Pads without a net: CN1 3; R2 4 5 6; U1 1 2 4; U10 6 7 10; USB1 A8 B8

## Via types
v1: diameter 0.6, hole 0.3, Top Layer to Bottom Layer, 41 vias

## Routing (per net, layer and track width the routed paths; a pad name or vN(x,y) marks a point on that pad's centre or on a via; arc(x,y) is an arc through that point)
5V: length 14.9
  Bottom Layer w0.254: U2.3 40.09,16.4 41.7,14.79 C3.2 43.63,13.1 U1.8 43.69,10.75 R2.1
GND: length 1.7
  Bottom Layer w0.2: v1(22.8,46.7) 22.8,47.2 22.5,47.5 U10.9
  vias: v1(15.2,54.1) v1(15.2,53.4) v1(15.2,52.7) v1(15.2,52) v1(15.9,54.1) v1(15.9,53.4) v1(15.9,52.7) v1(15.9,52) v1(22.8,46) v1(25.6,46.6) v1(25.6,45.9) v1(26.3,46.6) v1(26.3,45.9) v1(27,46.6) v1(27,45.9) v1(27.7,46.6) v1(27.7,45.9) v1(36.6,15) v1(36.6,14.3) v1(36.6,13.6) v1(36.6,12.9) v1(36.8,21.4) v1(36.8,20.7) v1(37.3,15) v1(37.3,14.3) v1(37.3,13.6) v1(37.3,12.9) v1(37.5,21.4) v1(37.5,20.7) v1(38.2,21.4) v1(38.2,20.7) v1(38.9,21.4) v1(38.9,20.7)
VCC: length 13.9
  Top Layer w0.2: v1(18.3,52.4) 17,51.1 17,46.8 17.9,45.9 v1(19.2,45.9)
  Bottom Layer w0.2: v1(19.2,45.9) C5.2 18.1,44.9 17.8,45.2 17.8,46.6 18.2,47 U10.1
$1N762: length 12.1
  Top Layer w0.254: v1(46.8,17) 46.8,10.55 R2.2
  Bottom Layer w0.254: 46.23,18.64 46.23,17.56 v1(46.8,17)
$1N878: length 14
  Top Layer w0.2: v1(17.8,49.4) 17.8,50 18.2,50.4 21.3,50.4 21.9,51 v1(21.9,57.1)
  Bottom Layer w0.2: USB1.B5 21.85,57.05 v1(21.9,57.1) ; v1(17.8,49.4) 18.2,49 U10.5
$1N881: length 20.2
  Bottom Layer w0.2: USB1.A5 18.85,57.75 18.1,58.5 15.3,58.5 14.2,57.4 14.2,50.1 15.8,48.5 U10.4
$1N891: length 6.8
  Bottom Layer w0.2: RVS1.2 22.95,44.95 23.5,45.5 23.5,47.5 23,48 U10.8
$1N943: length 28.6
  Bottom Layer w0.2: USB1.B6 20.85,57.55 19.85,58.55 ; U10.2 15.4,47.5 13.2,49.7 13.2,57.8 14.75,59.35 19.04,59.35 19.85,58.55 ; 19.85,58.55 USB1.A6
$1N946: length 26.2
  Bottom Layer w0.2: U10.3 15.6,48 13.7,49.9 13.7,57.6 15,58.9 18.6,58.9 19.35,58.15 USB1.B7
  Bottom Layer w0.254: USB1.B7 19.35,54.45 19.6,54.2 20.1,54.2 20.35,54.45 USB1.A7
$1N1655: length 9.4
  Top Layer w0.2: v1(45.8,14.9) 45.8,18.9 44.9,19.8 42.67,19.8
  Bottom Layer w0.2: 46.23,13.16 46.23,14.46 v1(45.8,14.9)
$1N1658: length 6.4
  Top Layer w0.2: 42.67,18.1 43.5,18.1 44.5,17.1 v1(44.5,14.9)
  Bottom Layer w0.2: v1(44.5,14.9) 44.96,14.43 U1.7
$1N1664: length 7.1
  Top Layer w0.2: CN1.4 40,24.19 40,21.23 41.33,19.9 41.61,19.9 41.31,19.6 41.31,18.5 41.61,18.2

## Copper pours and planes (outline as drawn; the poured copper is in the pictures)
GND on Bottom Layer: -15.3,70.5 67.8,70.5 67.8,-4.7 -15.3,-4.7
VCC on Bottom Layer: 17.4,56.2 50.2,56.2 50.2,45.5 17.4,45.5
VDD on Bottom Layer: 34.7,44.4 46.33,44.4 46.33,17.5 34.7,17.5

Small or netless copper shapes (teardrops, artwork), in the pictures only: 6 on Top Layer, 29 on Bottom Layer

## Text on the board
Bottom Silkscreen Layer: GND | SW | VCC
Top Silkscreen Layer: PWMA | PWMB | PWMA  PWMB | 用焊锡短接 | 二选一 | 正相和反相 | PWM选择

# Board PCB4
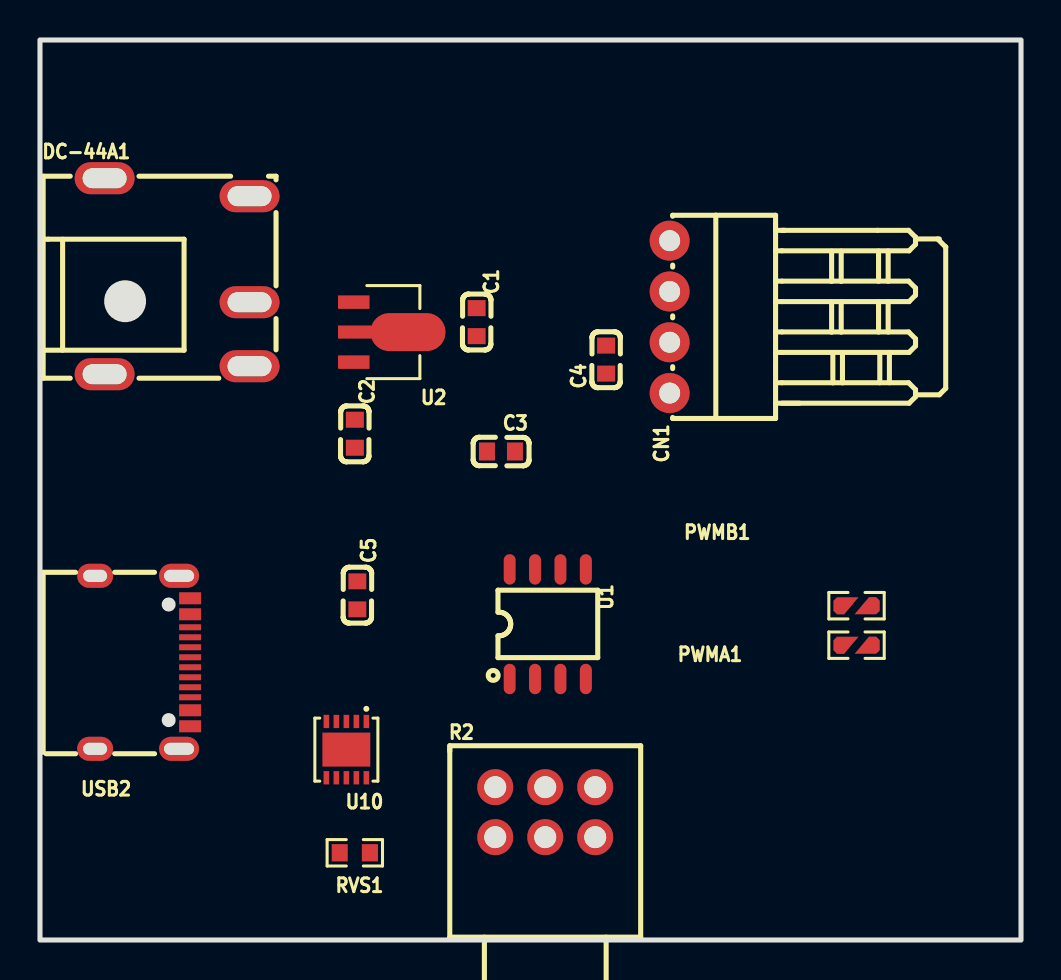
[diagram p5: board, top side]
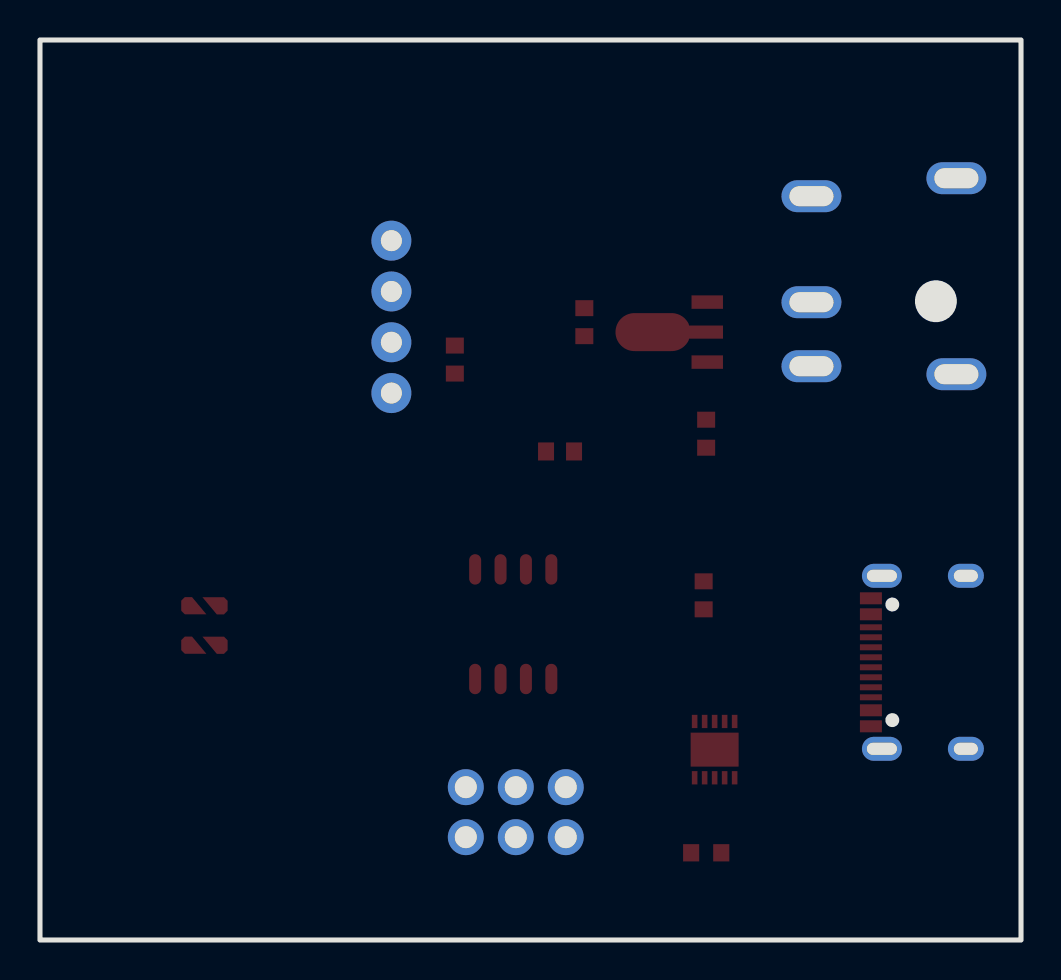
[diagram p6: board, bottom side, seen from below]

Outline 49.07 x 45 mm; copper layers: Top Layer, Bottom Layer. Coordinates in mm from the lower left corner of the outline.
Outline path: rectangle 0,45 49.07,0
Stack: Top Layer 0.035mm / Dielectric1 1.51mm FR4 er 4.5 / Bottom Layer 0.035mm

## Design rules (mm)
template: JLCPCB Capability(Two Layers Board)
spacing copperThickness1oz (default): track to track 0.102, other pairs 0.152 to 0.3
spacing copperThickness2oz: track to track 0.203, other pairs 0.152 to 0.3
track width copperThickness1oz (default): min 0.127, default 0.254, max 2.54
track width copperThickness2oz: min 0.203, default 0.254, max 2.54
differential pair differentialPair (default): width min 0.127, default 0.254, max 2.54; gap min 0.152, default 0.152
via viaSize (default): diameter min 0.5, default 0.61, max 10; hole min 0.3, default 0.305, max 6.3

## Placement (name value [footprint] x y rotation side)
C1  10uF  [C0603]  21.84 30.89 270 top
C2  10uF  [C0603]  15.75 25.31 90 top
C3  10uF  [C0603]  23.06 24.43 180 top
C4  10uF  [C0603]  28.32 29.02 90 top
C5  1uF  [C0603]  15.88 17.23 270 top
CN1  KF2510-4AGW-GW  [CONN-TH_4P-P2.54_CAX_KF2510-4AGW-GW]  31.5 31.16 90 top
DC-44A1  DC-044A-20A  [DC-IN-TH_DC-044A-20A]  6.86 33.19 0 top
PWMA1  -  [cs]  33.28 16.45 0 top
PWMB1  -  [cs]  33.28 18.42 0 top
R2  10kΩ  [RES-ADJ-TH_RK09712200MY]  25.27 6.39 0 top
RVS1  10kΩ  [R0603]  15.75 4.36 180 top
U1  GP9101-F20K-L2H1-SW  [SOP-8_L5.0-W3.9-P1.27-LS6.0-BL]  25.4 15.79 0 top
U2  AMS1117-5.0  [SOT-89-3_L4.5-W2.5-P1.50-LS4.2-BR]  17.05 30.39 180 top
U10  HUSB238-002D  [TDFN-10_L3.0-W3.0-P0.50-BL-EP]  15.33 9.52 180 top
USB2  TYPE-C 16PIN 2MD(073)  [USB-C-SMD_TYPE-C-6PIN-2MD-073]  5.13 13.89 270 top

## Footprints (pads in the part's own frame, mm; a bottom-side part is the same pattern mirrored in y, then rotated)
C0603
  rect 0.8x0.9 smd: 1(-0.7,0) 2(0.7,0)
CONN-TH_4P-P2.54_CAX_KF2510-4AGW-GW
  round 2 hole 1.05: 1(-3.81,0) 2(-1.27,0) 3(1.27,0) 4(3.81,0)
cs
  custom 1.26x0.86 smd: 1(7.04,-1.66) 2(8.1,-1.764)
DC-IN-TH_DC-044A-20A
  oval 3x1.6 hole 2.2x1: 1(3.625,-4.5) 2(3.625,4.001) 3(3.625,-1.3) 4(-3.625,-4.9) 5(-3.625,4.9)
R0603
  rect 0.806x0.864 smd: 1(-0.753,0) 2(0.753,0)
RES-ADJ-TH_RK09712200MY
  round 1.8 hole 1.1: 1(-2.5,1.25) 2(0,1.25) 3(2.5,1.25) 4(-2.5,-1.25) 5(0,-1.25) 6(2.5,-1.25)
SOP-8_L5.0-W3.9-P1.27-LS6.0-BL
  oval 0.6x1.52 smd: 1(-1.905,-2.74) 2(-0.635,-2.74) 3(0.635,-2.74) 4(1.905,-2.74) 5(1.905,2.74) 6(0.635,2.74) 7(-0.635,2.74) 8(-1.905,2.74)
SOT-89-3_L4.5-W2.5-P1.50-LS4.2-BR
  rect 1.575x0.672 smd: 1(1.356,-1.5) 3(1.356,1.5)
  custom 5.377x1.9 smd: 2(-1.356,0)
TDFN-10_L3.0-W3.0-P0.50-BL-EP
  rect 0.28x0.665 smd: 1(-1,-1.407) 2(-0.5,-1.407) 3(0,-1.407) 4(0.5,-1.407) 5(1,-1.407) 6(1,1.407) 7(0.5,1.407) 8(0,1.407) 9(-0.5,1.407) 10(-1,1.407)
  rect 2.4x1.7 smd: 11(0,0)
USB-C-SMD_TYPE-C-6PIN-2MD-073
  rect 0.6x1.1 smd: 1(-3.2,2.375) 2(-2.4,2.375) 11(2.4,2.375) 12(3.2,2.375)
  rect 0.3x1.1 smd: 3(-1.75,2.375) 4(-1.25,2.375) 5(-0.75,2.375) 6(-0.25,2.375) 7(0.25,2.375) 8(0.75,2.375) 9(1.25,2.375) 10(1.75,2.375)
  oval 1.2x2 hole 0.6x1.5: 13(-4.325,1.825) 14(4.325,1.825)
  oval 1.2x1.8 hole 0.6x1.2: 13(-4.325,-2.375) 14(4.325,-2.375)

## Nets
As in the schematic.

Pads without a net: CN1 3; R2 2 4 5 6; U1 1 2 4; U10 6 7 10; USB2 3 9

# Board 焊接烟雾净化器V1.2_1
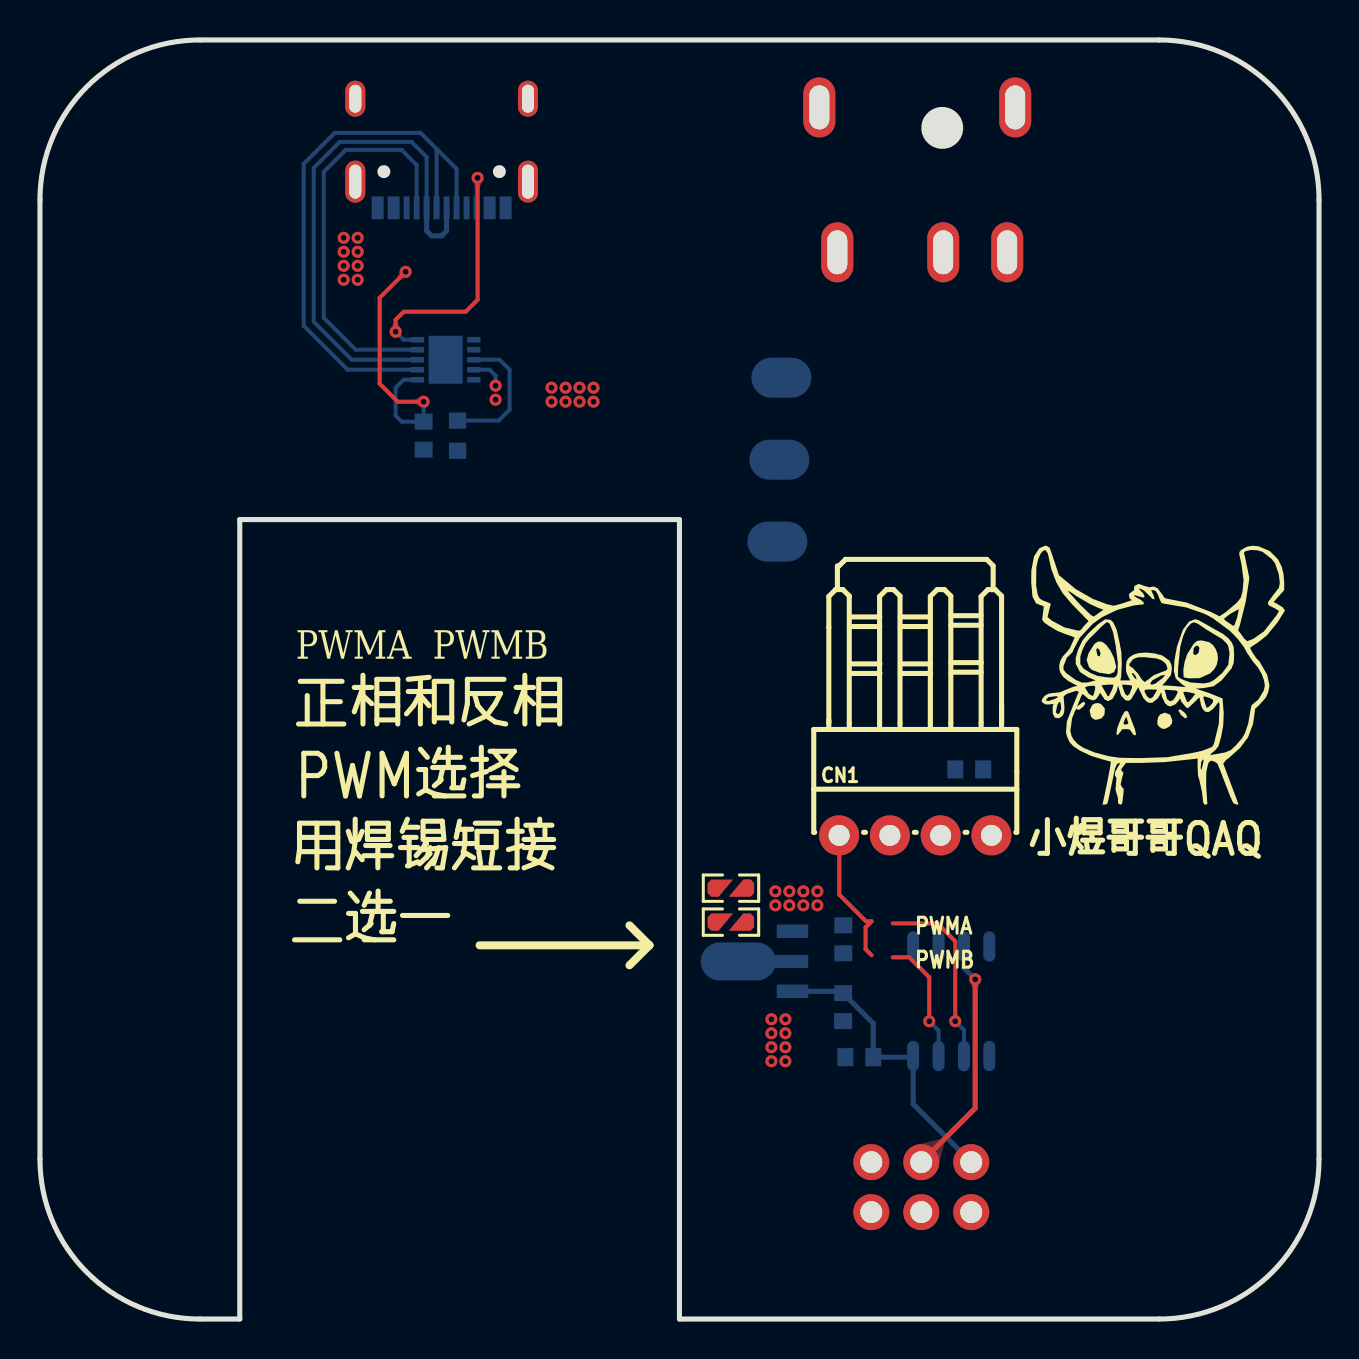
[diagram p7: board, top side]
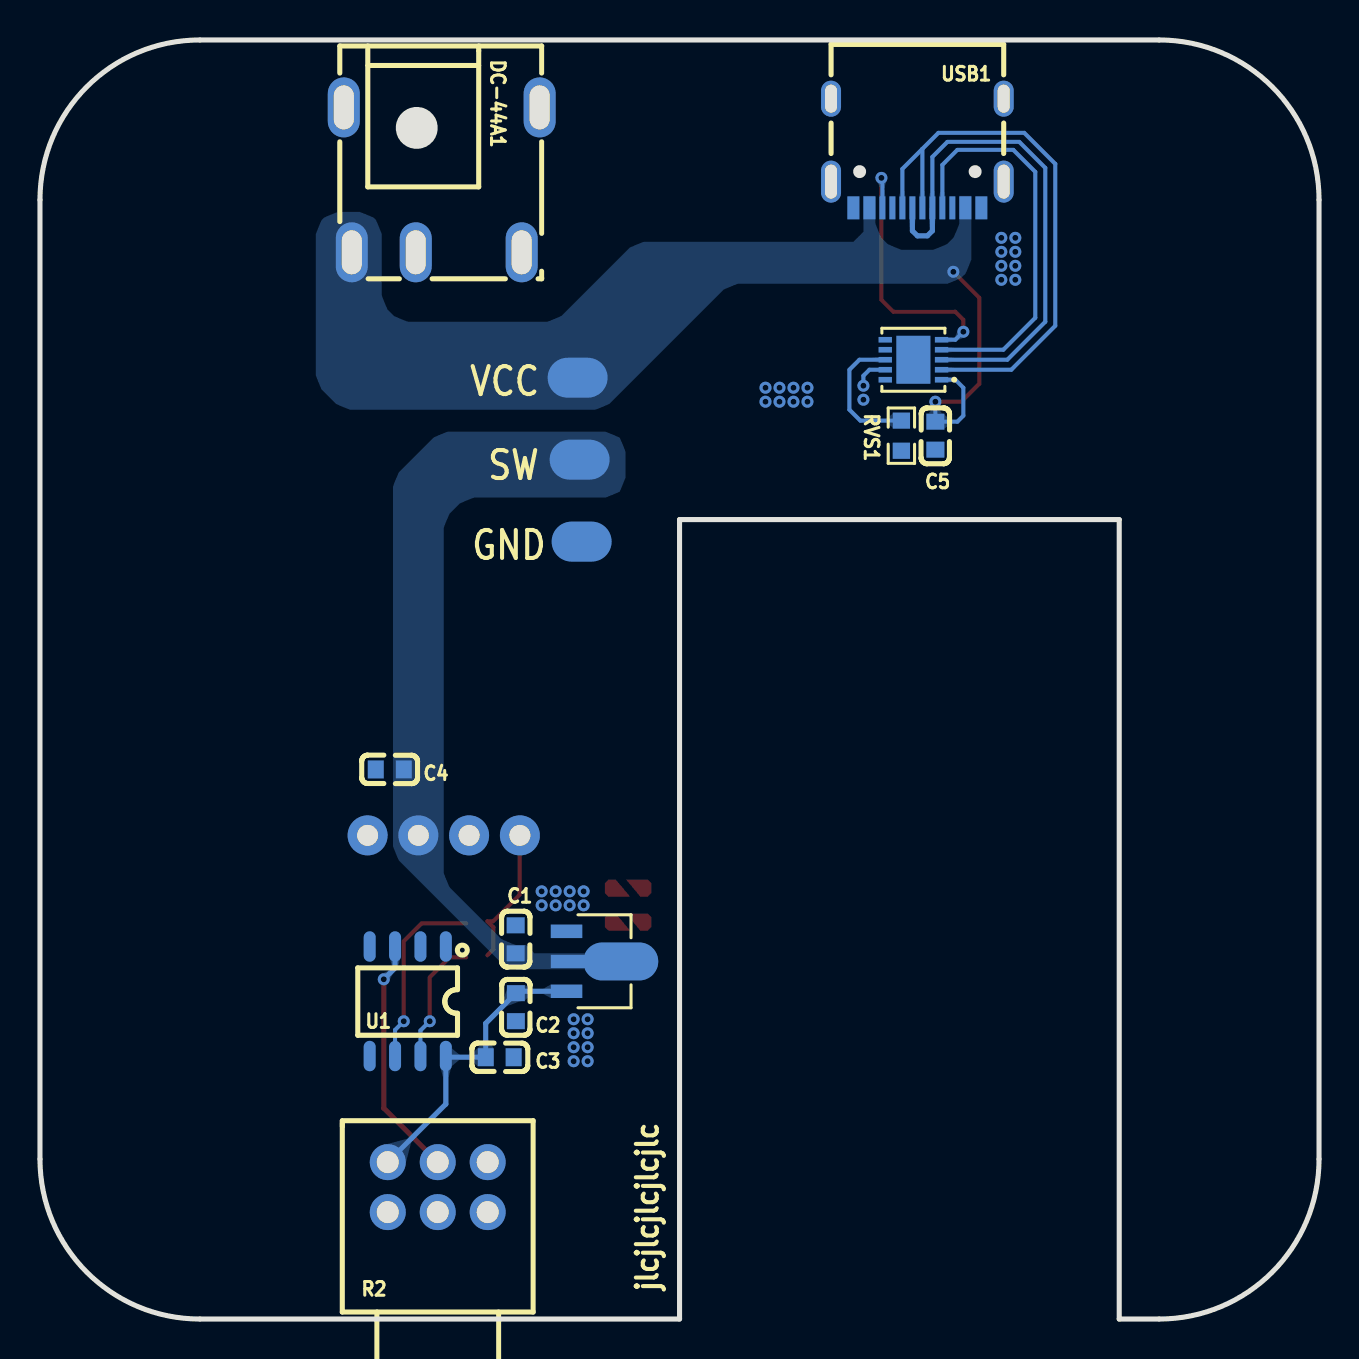
[diagram p8: board, bottom side, seen from below]

Outline 64 x 64 mm; copper layers: Top Layer, Bottom Layer. Coordinates in mm from the lower left corner of the outline.
Outline path: 0,56 arc(2.34,61.66) 8,64 56,64 arc(61.66,61.66) 64,56 64,8 arc(61.66,2.34) 56,0 32,0 32,40 10,40 10,0 8,0 arc(2.34,2.34) 0,8 0,56
Stack: Top Layer 0.035mm / Dielectric1 1.51mm FR4 er 4.5 / Bottom Layer 0.035mm

## Design rules (mm)
spacing safeClearance (default): track to track 0.152, other pairs 0.152 to 0.3
track width trackWidth (default): min 0.127, default 0.254, max 2.54
differential pair differentialPair (default): width min 0.127, default 0.254, max 2.54; gap min 0.152, default 0.152
via viaSize (default): diameter min 0.5, default 0.61, max 10; hole min 0.3, default 0.305, max 6

## Placement (name value [footprint] x y rotation side)
C1  10uF  [C0603]  40.2 19 270 bottom
C2  10uF  [C0603]  40.19 15.6 90 bottom
C3  10uF  [C0603]  41 13.1 0 bottom
C4  10uF  [C0603]  46.5 27.5 180 bottom
C5  1uF  [C0603]  19.2 44.2 90 bottom
CN1  KF2510-4AGW-GW  [CONN-TH_4P-P2.54_CAX_KF2510-4AGW-GW]  43.8 24.2 180 top
DC-44A1  DC-044A-20A  [DC-IN-TH_DC-044A-20A]  43.9 57 270 bottom
NOREF  -  [Pad_e150]  36.9 38.9 0 top
NOREF#2  -  [Pad_e144]  37.1 47.1 0 top
NOREF#3  -  [Pad_e146]  37 43 0 top
PWMA1  -  [cs]  42.14 19.85 180 top
PWMB1  -  [cs]  42.14 18.15 180 top
R2  100kΩ  [RES-ADJ-TH_RK09712200MY]  44.1 6.6 180 bottom
RVS1  10kΩ  [R0603]  20.9 44.2 90 bottom
U1  GP9101-F20K-L2H1-SW  [SOP-8_L5.0-W3.9-P1.27-LS6.0-BL]  45.6 15.9 0 bottom
U2  ME6203A50PG  [SOT-89_L4.5-W2.5-P1.50-LS4.2-BR]  36.3 17.9 0 bottom
U10  HUSB238-002D  [TDFN-10_L3.0-W3.0-P0.50-BL-EP]  20.3 48 90 bottom
USB1  -  [USB_C-SMD_TYPE_C16PIN]  20.1 58.7 0 bottom

## Footprints (pads in the part's own frame, mm; a bottom-side part is the same pattern mirrored in y, then rotated)
C0603
  rect 0.8x0.9 smd: 1(-0.7,0) 2(0.7,0)
CONN-TH_4P-P2.54_CAX_KF2510-4AGW-GW
  round 2 hole 1.05: 1(-3.81,0) 2(-1.27,0) 3(1.27,0) 4(3.81,0)
cs
  custom 1.26x0.86 smd: 1(7.04,-1.66) 2(8.1,-1.764)
DC-IN-TH_DC-044A-20A
  oval 3x1.6 hole 2.2x1: 1(3.625,-4.5) 2(3.625,4.001) 3(3.625,-1.3) 4(-3.625,-4.9) 5(-3.625,4.9)
Pad_e144
  oval 3x2 smd far side: 1(0,0)
Pad_e146
  oval 3x2 smd far side: 1(0,0)
Pad_e150
  oval 3x2 smd far side: 1(0,0)
R0603
  rect 0.806x0.864 smd: 1(-0.753,0) 2(0.753,0)
RES-ADJ-TH_RK09712200MY
  round 1.8 hole 1.1: 1(-2.5,1.25) 2(0,1.25) 3(2.5,1.25) 4(-2.5,-1.25) 5(0,-1.25) 6(2.5,-1.25)
SOP-8_L5.0-W3.9-P1.27-LS6.0-BL
  oval 0.6x1.52 smd: 1(-1.905,-2.74) 2(-0.635,-2.74) 3(0.635,-2.74) 4(1.905,-2.74) 5(1.905,2.74) 6(0.635,2.74) 7(-0.635,2.74) 8(-1.905,2.74)
SOT-89_L4.5-W2.5-P1.50-LS4.2-BR
  rect 1.575x0.673 smd: 1(1.357,-1.498) 3(1.357,1.501)
  custom 5.378x1.9 smd: 2(-1.357,0.007)
TDFN-10_L3.0-W3.0-P0.50-BL-EP
  rect 0.28x0.665 smd: 1(-1,-1.407) 2(-0.5,-1.407) 3(0,-1.407) 4(0.5,-1.407) 5(1,-1.407) 6(1,1.407) 7(0.5,1.407) 8(0,1.407) 9(-0.5,1.407) 10(-1,1.407)
  rect 2.4x1.7 smd: 11(0,0)
USB_C-SMD_TYPE_C16PIN
  oval 1x2.1 hole 0.6x1.7: 1(-4.32,1.788) 2(4.32,1.788)
  oval 1x1.8 hole 0.6x1.4: 3(-4.32,-2.362) 4(4.32,-2.362)
  rect 0.6x1.15 smd: A1B12(-3.2,3.1) A4B9(-2.4,3.1) B1A12(3.2,3.1) B4A9(2.4,3.1)
  rect 0.3x1.15 smd: A5(-1.25,3.1) A6(-0.25,3.1) A7(0.25,3.1) A8(-1.75,3.1) B5(1.75,3.1) B6(0.75,3.1) B7(-0.75,3.1) B8(1.25,3.1)

## Nets
5V: C2.2 C3.2 R2.1 U1.8 U2.3
GND: C1.1 C2.1 C3.1 C4.1 C5.1 CN1.1 DC-44A1.2 DC-44A1.3 DC-44A1.4 DC-44A1.5 NOREF.1 R2.3 RVS1.1 U1.5 U2.1 U10.9 U10.11 USB1.1 USB1.2 USB1.3 USB1.4 USB1.A1B12 USB1.B1A12
VCC: C5.2 DC-44A1.1 NOREF#2.1 U10.1 USB1.A4B9 USB1.B4A9
VDD: C1.2 C4.2 CN1.2 NOREF#3.1 U2.2
$1N762: R2.2 U1.3
$1N878: U10.5 USB1.B5
$1N881: U10.4 USB1.A5
$1N891: RVS1.2 U10.8
$1N943: U10.2 USB1.A6 USB1.B6
$1N946: U10.3 USB1.A7 USB1.B7
$1N1655: PWMA1.1 U1.6
$1N1658: PWMB1.1 U1.7
$1N1664: CN1.4 PWMA1.2 PWMB1.2

Pads without a net: CN1 3; R2 4 5 6; U1 1 2 4; U10 6 7 10; USB1 A8 B8

## Via types
v1: diameter 0.6, hole 0.3, Top Layer to Bottom Layer, 41 vias

## Routing (per net, layer and track width the routed paths; a pad name or vN(x,y) marks a point on that pad's centre or on a via; arc(x,y) is an arc through that point)
5V: length 14.9
  Bottom Layer w0.254: U2.3 40.09,16.4 41.7,14.79 C3.2 43.63,13.1 U1.8 43.69,10.75 R2.1
GND: length 1.7
  Bottom Layer w0.2: U10.9 22.5,47.5 22.8,47.2 v1(22.8,46.7)
  vias: v1(15.2,54.1) v1(15.2,53.4) v1(15.2,52.7) v1(15.2,52) v1(15.9,54.1) v1(15.9,53.4) v1(15.9,52.7) v1(15.9,52) v1(22.8,46) v1(25.6,46.6) v1(25.6,45.9) v1(26.3,46.6) v1(26.3,45.9) v1(27,46.6) v1(27,45.9) v1(27.7,46.6) v1(27.7,45.9) v1(36.6,15) v1(36.6,14.3) v1(36.6,13.6) v1(36.6,12.9) v1(36.8,21.4) v1(36.8,20.7) v1(37.3,15) v1(37.3,14.3) v1(37.3,13.6) v1(37.3,12.9) v1(37.5,21.4) v1(37.5,20.7) v1(38.2,21.4) v1(38.2,20.7) v1(38.9,21.4) v1(38.9,20.7)
VCC: length 13.9
  Top Layer w0.2: v1(19.2,45.9) 17.9,45.9 17,46.8 17,51.1 v1(18.3,52.4)
  Bottom Layer w0.2: v1(19.2,45.9) C5.2 18.1,44.9 17.8,45.2 17.8,46.6 18.2,47 U10.1
$1N762: length 12.1
  Top Layer w0.254: v1(46.8,17) 46.8,10.55 R2.2
  Bottom Layer w0.254: 46.23,18.64 46.23,17.56 v1(46.8,17)
$1N878: length 14
  Top Layer w0.2: v1(21.9,57.1) 21.9,51 21.3,50.4 18.2,50.4 17.8,50 v1(17.8,49.4)
  Bottom Layer w0.2: v1(17.8,49.4) 18.2,49 U10.5 ; USB1.B5 21.85,57.05 v1(21.9,57.1)
$1N881: length 20.2
  Bottom Layer w0.2: USB1.A5 18.85,57.75 18.1,58.5 15.3,58.5 14.2,57.4 14.2,50.1 15.8,48.5 U10.4
$1N891: length 6.8
  Bottom Layer w0.2: U10.8 23,48 23.5,47.5 23.5,45.5 22.95,44.95 RVS1.2
$1N943: length 28.6
  Bottom Layer w0.2: 19.85,58.55 19.04,59.35 14.75,59.35 13.2,57.8 13.2,49.7 15.4,47.5 U10.2 ; 19.85,58.55 20.85,57.55 USB1.B6 ; 19.85,58.55 USB1.A6
$1N946: length 26.2
  Bottom Layer w0.2: USB1.B7 19.35,58.15 18.6,58.9 15,58.9 13.7,57.6 13.7,49.9 15.6,48 U10.3
  Bottom Layer w0.254: USB1.B7 19.35,54.45 19.6,54.2 20.1,54.2 20.35,54.45 USB1.A7
$1N1655: length 9.4
  Top Layer w0.2: 42.67,19.8 44.9,19.8 45.8,18.9 v1(45.8,14.9)
  Bottom Layer w0.2: v1(45.8,14.9) 46.23,14.46 46.23,13.16
$1N1658: length 6.4
  Top Layer w0.2: v1(44.5,14.9) 44.5,17.1 43.5,18.1 42.67,18.1
  Bottom Layer w0.2: v1(44.5,14.9) 44.96,14.43 U1.7
$1N1664: length 7.1
  Top Layer w0.2: 41.61,18.2 41.31,18.5 41.31,19.6 41.61,19.9 41.33,19.9 40,21.23 40,24.19 CN1.4

## Copper pours and planes (outline as drawn; the poured copper is in the pictures)
GND on Top Layer: -4.6,74.4 73,74.4 73,-9.6 -4.6,-9.6
GND on Bottom Layer: -15.2,70.3 67.9,70.3 67.9,-4.9 -15.2,-4.9
VCC on Bottom Layer: 17.4,56.2 50.2,56.2 50.2,45.5 17.4,45.5
VDD on Bottom Layer: 34.7,44.4 46.33,44.4 46.33,17.5 34.7,17.5

Small or netless copper shapes (teardrops, artwork), in the pictures only: 6 on Top Layer, 29 on Bottom Layer

## Text on the board
Bottom Silkscreen Layer: jlcjlcjlcjlcjlc | GND | SW | VCC
Top Silkscreen Layer: PWMA | PWMB | PWMA  PWMB | 用焊锡短接 | 二选一 | 正相和反相 | PWM选择 | 小煜哥哥QAQ

# Board PCB4_1
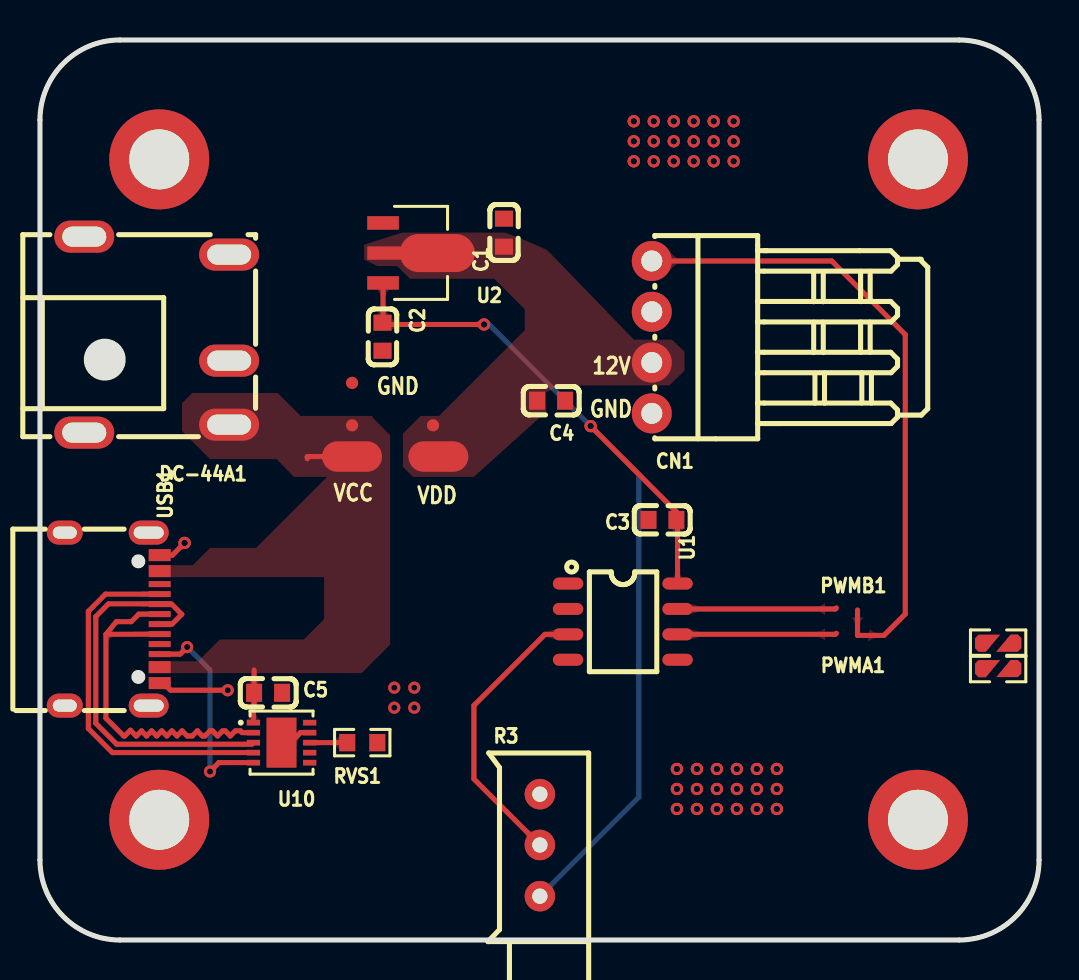
[diagram p9: board, top side]
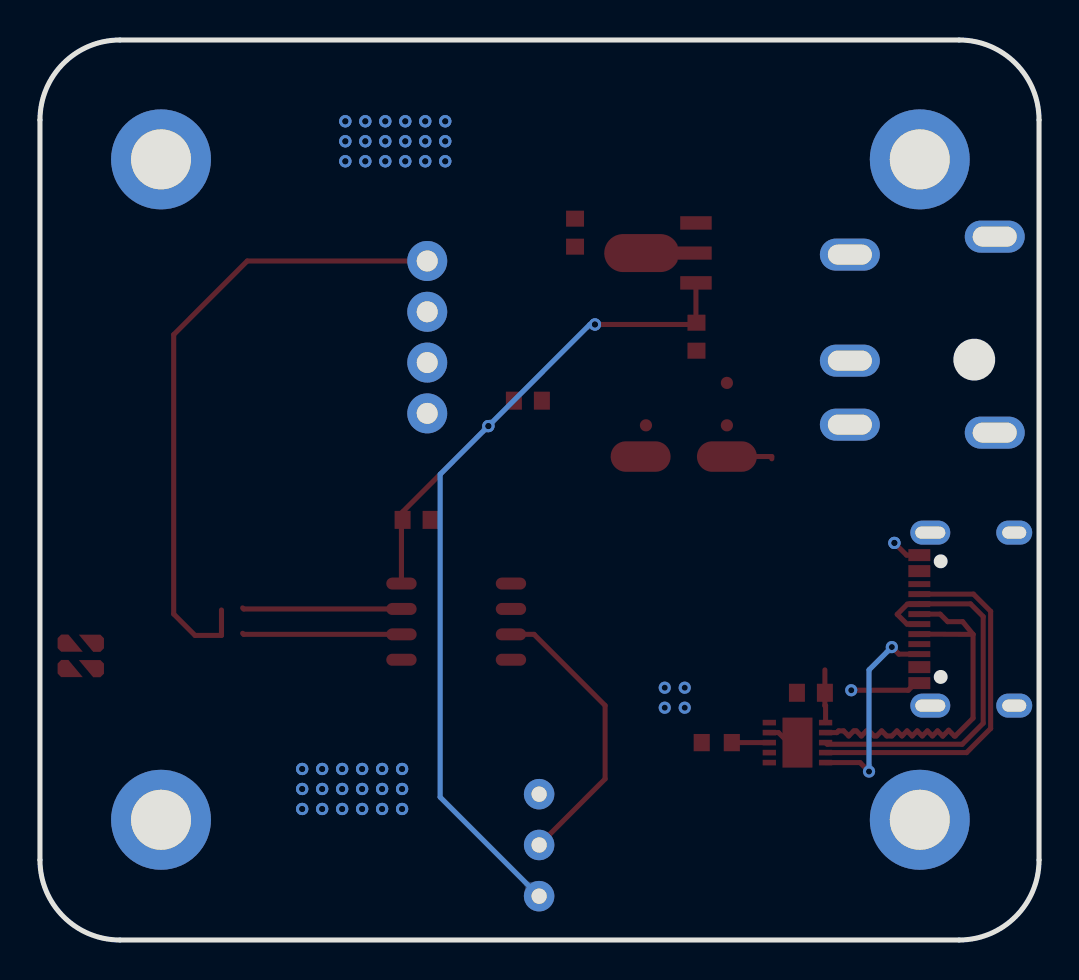
[diagram p10: board, bottom side, seen from below]

Outline 50 x 45 mm; copper layers: Top Layer, Bottom Layer. Coordinates in mm from the lower left corner of the outline.
Outline path: 0,41 0,4 arc(1.17,1.17) 4,0 46,0 arc(48.83,1.17) 50,4 50,41 arc(48.83,43.83) 46,45 4,45 arc(1.17,43.83) 0,41
Stack: Top Layer 0.035mm / Dielectric1 1.51mm FR4 er 4.5 / Bottom Layer 0.035mm

## Design rules (mm)
net $1N2819: DP1
net $1N2796: DP1
template: JLCPCB Capability(Two Layers Board)
spacing copperThickness1oz (default): track to track 0.102, other pairs 0.152 to 0.3
spacing copperThickness2oz: track to track 0.203, other pairs 0.152 to 0.3
track width copperThickness1oz (default): min 0.127, default 0.254, max 2.54
track width copperThickness2oz: min 0.203, default 0.254, max 2.54
differential pair differentialPair (default): width min 0.127, default 0.254, max 2.54; gap min 0.152, default 0.152
via viaSize (default): diameter min 0.5, default 0.61, max 10; hole min 0.3, default 0.305, max 6.3

## Placement (name value [footprint] x y rotation side)
C1  10uF  [C0603]  23.22 35.37 270 top
C2  10uF  [C0603]  17.14 30.16 90 top
C3  10uF  [C0603]  31.15 21.01 0 top
C4  10uF  [C0603]  25.58 26.97 180 top
C5  1uF  [C0603]  11.42 12.36 180 top
CN1  KF2510-4AGW-GW  [CONN-TH_4P-P2.54_CAX_KF2510-4AGW-GW]  30.62 30.14 90 top
DC-44A1  DC-044A-20A  [DC-IN-TH_DC-044A-20A]  5.84 30.27 0 top
NOREF  -  [Pad_e25]  19.67 25.73 0 top
NOREF#2  -  [Pad_e23]  15.62 27.86 0 top
NOREF#3  -  [Pad_e26]  15.62 25.73 0 top
NOREF#4  -  [Pad_e19]  15.62 24.17 0 top
NOREF#5  -  [Pad_e37]  5.97 6.01 0 top
NOREF#6  -  [Pad_e21]  19.94 24.17 0 top
NOREF#7  -  [Pad_e34]  43.94 6.01 0 top
NOREF#8  -  [Pad_e28]  43.94 39.03 0 top
NOREF#9  -  [Pad_e40]  5.97 39.03 0 top
PWMA1  -  [cs]  40.39 15.28 0 top
PWMB1  -  [cs]  40.39 16.55 0 top
R3  100kΩ  [RES-ADJ-TH_3296X-8MM]  25.02 4.74 0 top
RVS1  10kΩ  [R0603]  16.13 9.87 180 top
U1  GP9101-F1K-L2H1-SW  [SOP-8_L5.0-W3.9-P1.27-LS6.0-BL]  29.17 15.92 270 top
U2  ME6203A50PG  [SOT-89_L4.5-W2.5-P1.50-LS4.2-BR]  18.53 34.36 180 top
U10  HUSB238_002DD  [DFN-10_L3.0-W3.0-P0.50-BL-EP2.5]  12.09 9.87 270 top
USB1  TYPE-C 16PIN 2MD(073)  [USB-C-SMD_TYPE-C-6PIN-2MD-073]  3.62 16.04 270 top

## Footprints (pads in the part's own frame, mm; a bottom-side part is the same pattern mirrored in y, then rotated)
C0603
  rect 0.8x0.9 smd: 1(-0.7,0) 2(0.7,0)
CONN-TH_4P-P2.54_CAX_KF2510-4AGW-GW
  round 2 hole 1.05: 1(-3.81,0) 2(-1.27,0) 3(1.27,0) 4(3.81,0)
cs
  custom 1.26x0.86 smd: 1(7.04,-1.66) 2(8.1,-1.764)
DC-IN-TH_DC-044A-20A
  oval 3x1.6 hole 2.2x1: 1(3.625,-4.5) 2(3.625,4.001) 3(3.625,-1.3) 4(-3.625,-4.9) 5(-3.625,4.9)
DFN-10_L3.0-W3.0-P0.50-BL-EP2.5
  rect 0.28x0.665 smd: 1(-1,-1.407) 2(-0.5,-1.407) 3(0,-1.407) 4(0.5,-1.407) 5(1,-1.407) 6(1,1.407) 7(0.5,1.407) 8(0,1.407) 9(-0.5,1.407) 10(-1,1.407)
  rect 2.5x1.5 smd: 11(0,0)
Pad_e19
  oval 3x1.524 smd: 15(0,0)
Pad_e21
  oval 3x1.524 smd: 15(0,0)
Pad_e23
  round 0.61 smd: TP1(0,0)
Pad_e25
  round 0.61 smd: TP3(0,0)
Pad_e26
  round 0.61 smd: TP4(0,0)
Pad_e28
  round 5 hole 3: 16(0,0)
Pad_e34
  round 5 hole 3: 16(0,0)
Pad_e37
  round 5 hole 3: 16(0,0)
Pad_e40
  round 5 hole 3: 16(0,0)
R0603
  rect 0.806x0.864 smd: 1(-0.753,0) 2(0.753,0)
RES-ADJ-TH_3296X-8MM
  round 1.524 hole 0.762: 1(0,2.55) 2(0,0.01) 3(0,-2.55)
SOP-8_L5.0-W3.9-P1.27-LS6.0-BL
  oval 0.6x1.52 smd: 1(-1.905,-2.74) 2(-0.635,-2.74) 3(0.635,-2.74) 4(1.905,-2.74) 5(1.905,2.74) 6(0.635,2.74) 7(-0.635,2.74) 8(-1.905,2.74)
SOT-89_L4.5-W2.5-P1.50-LS4.2-BR
  rect 1.575x0.673 smd: 1(1.357,-1.498) 3(1.357,1.501)
  custom 5.378x1.9 smd: 2(-1.357,0.007)
USB-C-SMD_TYPE-C-6PIN-2MD-073
  rect 0.6x1.1 smd: 1(-3.2,2.375) 2(-2.4,2.375) 11(2.4,2.375) 12(3.2,2.375)
  rect 0.3x1.1 smd: 3(-1.75,2.375) 4(-1.25,2.375) 5(-0.75,2.375) 6(-0.25,2.375) 7(0.25,2.375) 8(0.75,2.375) 9(1.25,2.375) 10(1.75,2.375)
  oval 1.2x2 hole 0.6x1.5: 13(-4.325,1.825) 14(4.325,1.825)
  oval 1.2x1.8 hole 0.6x1.2: 13(-4.325,-2.375) 14(4.325,-2.375)

## Nets
5V: C2.2 C3.2 R3.3 U1.8 U2.3
GND: C1.1 C2.1 C3.1 C4.1 C5.1 CN1.1 DC-44A1.2 DC-44A1.3 DC-44A1.4 DC-44A1.5 NOREF#2.TP1 R3.1 RVS1.1 U1.5 U2.1 U10.9 U10.11 USB1.1 USB1.12 USB1.13 USB1.14
VCC: C5.2 DC-44A1.1 NOREF#3.TP4 NOREF#4.15 U10.1 USB1.2 USB1.11
VDD: C1.2 C4.2 CN1.2 NOREF.TP3 NOREF#6.15 U2.2
$1N762: R3.2 U1.3
$1N881: U10.4 USB1.4
$1N891: RVS1.2 U10.8
$1N1655: PWMA1.1 U1.6
$1N1658: PWMB1.1 U1.7
$1N1664: CN1.4 PWMA1.2 PWMB1.2
$1N2783: U10.5 USB1.10
$1N2796: U10.2 USB1.6 USB1.8
$1N2819: U10.3 USB1.5 USB1.7

Pads without a net: CN1 3; NOREF#5 16; NOREF#7 16; NOREF#8 16; NOREF#9 16; U1 1 2 4; U10 6 7 10; USB1 3 9

## Via types
v1: diameter 0.61, hole 0.305, Top Layer to Bottom Layer, 85 vias

## Routing (per net, layer and track width the routed paths; a pad name or vN(x,y) marks a point on that pad's centre or on a via; arc(x,y) is an arc through that point)
5V: length 50.8
  Top Layer w0.254: U1.8 31.91,20.95 C3.2 31.85,21.4 v1(27.56,25.7) ; v1(22.23,30.78) 17.23,30.78 C2.2 17.17,30.89 17.17,32.85
  Bottom Layer w0.254: v1(22.23,30.78) 22.48,30.78 v1(27.56,25.7) 29.97,23.28 29.97,7.14 R3.3
GND: length 6.3
  Top Layer w0.254: 6.19,19.24 6.63,19.24 v1(7.24,19.85) ; v1(9.4,12.49) 6.54,12.49 6.19,12.84 ; U10.9 13.04,10.37 12.54,9.87 U10.11
  vias: v1(17.73,12.61) v1(17.73,11.61) v1(18.73,12.61) v1(18.73,11.61) v1(29.72,40.94) v1(29.72,40.94) v1(29.72,39.94) v1(29.72,39.94) v1(29.72,38.94) v1(29.72,38.94) v1(30.72,40.94) v1(30.72,40.94) v1(30.72,39.94) v1(30.72,39.94) v1(30.72,38.94) v1(30.72,38.94) v1(31.72,40.94) v1(31.72,40.94) v1(31.72,39.94) v1(31.72,39.94) v1(31.72,38.94) v1(31.72,38.94) v1(31.88,8.55) v1(31.88,8.55) v1(31.88,7.55) v1(31.88,7.55) v1(31.88,6.55) v1(31.88,6.55) v1(32.72,40.94) v1(32.72,40.94) v1(32.72,39.94) v1(32.72,39.94) v1(32.72,38.94) v1(32.72,38.94) v1(32.88,8.55) v1(32.88,8.55) v1(32.88,7.55) v1(32.88,7.55) v1(32.88,6.55) v1(32.88,6.55) v1(33.72,40.94) v1(33.72,40.94) v1(33.72,39.94) v1(33.72,39.94) v1(33.72,38.94) v1(33.72,38.94) v1(33.88,8.55) v1(33.88,8.55) v1(33.88,7.55) v1(33.88,7.55) v1(33.88,6.55) v1(33.88,6.55) v1(34.72,40.94) v1(34.72,40.94) v1(34.72,39.94) v1(34.72,39.94) v1(34.72,38.94) v1(34.72,38.94) v1(34.88,8.55) v1(34.88,8.55) v1(34.88,7.55) v1(34.88,7.55) v1(34.88,6.55) v1(34.88,6.55) v1(35.88,8.55) v1(35.88,8.55) v1(35.88,7.55) v1(35.88,7.55) v1(35.88,6.55) v1(35.88,6.55) v1(36.88,8.55) v1(36.88,8.55) v1(36.88,7.55) v1(36.88,7.55) v1(36.88,6.55) v1(36.88,6.55)
VCC: length 5
  Top Layer w0.254: 10.72,13.5 C5.2 10.72,11.72 10.68,11.72 U10.1 ; NOREF#4.15 13.38,24.17 13.38,24.06
$1N762: length 14.5
  Top Layer w0.254: R3.2 21.72,8.05 21.72,11.73 25.27,15.28 U1.3
$1N881: length 18.5
  Top Layer w0.254: USB1.4 3.28,17.29 2.42,16.43 2.42,10.57 3.63,9.37 U10.4
$1N891: length 2
  Top Layer w0.254: 15.45,9.87 RVS1.2 U10.8
$1N1655: length 8
  Top Layer w0.254: 39.86,15.33 39.8,15.28 U1.6
$1N1658: length 8
  Top Layer w0.254: 39.86,16.6 39.8,16.55 U1.7
$1N1664: length 32.3
  Top Layer w0.254: 40.92,16.5 40.92,15.23 42.24,15.23 43.31,16.3 43.31,30.27 39.62,33.95 CN1.4
$1N2783: length 10.6
  Top Layer w0.254: v1(7.37,14.65) 7.01,14.29 USB1.10 ; U10.5 8.95,8.87 v1(8.51,8.42)
  Bottom Layer w0.254: v1(7.37,14.65) 8.51,13.5 v1(8.51,8.42)
$1N2796: length 19.8
  Top Layer w0.254: 3.3,15.28 3.82,15.92 4.57,15.92 4.95,16.29 USB1.6 ; 3.3,15.28 USB1.8 ; 3.3,15.28 3.3,11.09 4.19,10.2 4.24,10.2 4.53,10.49 4.82,10.19 5.08,10.46 5.33,10.2 5.59,10.46 5.84,10.2 6.1,10.46 6.35,10.2 6.6,10.46 6.86,10.2 7.11,10.46 7.37,10.2 7.62,10.2 7.87,10.46 8.13,10.2 8.25,10.2 8.51,10.46 8.64,10.46 8.89,10.2 9.14,10.46 9.27,10.46 9.52,10.2 9.78,10.46 10.03,10.46 10.12,10.37 U10.2
$1N2819: length 19.8
  Top Layer w0.254: U10.3 10.6,9.79 3.84,9.79 2.79,10.84 2.79,16.17 3.43,16.81 5.98,16.81 USB1.5 6.59,16.79 7.1,16.28 6.61,15.79 USB1.7

## Copper pours and planes (outline as drawn; the poured copper is in the pictures)
GND on Top Layer: 0,45.13 50.17,45.13 50.17,-0.08 0,-0.08
GND on Bottom Layer: 0.13,45.25 50.17,45.25 50.17,-0.08 0.13,-0.08
VCC on Top Layer: 5.44,27.35 17.53,27.35 17.53,13.34 5.44,13.34
VDD on Top Layer: 16.22,35.38 32.26,35.38 32.26,23.16 16.22,23.16

Small or netless copper shapes (teardrops, artwork), in the pictures only: 43 on Top Layer, 9 on Bottom Layer

## Text on the board
Top Silkscreen Layer: VCC | GND | VDD | 12V
